# Altium project DGCtrl.PrjPcb
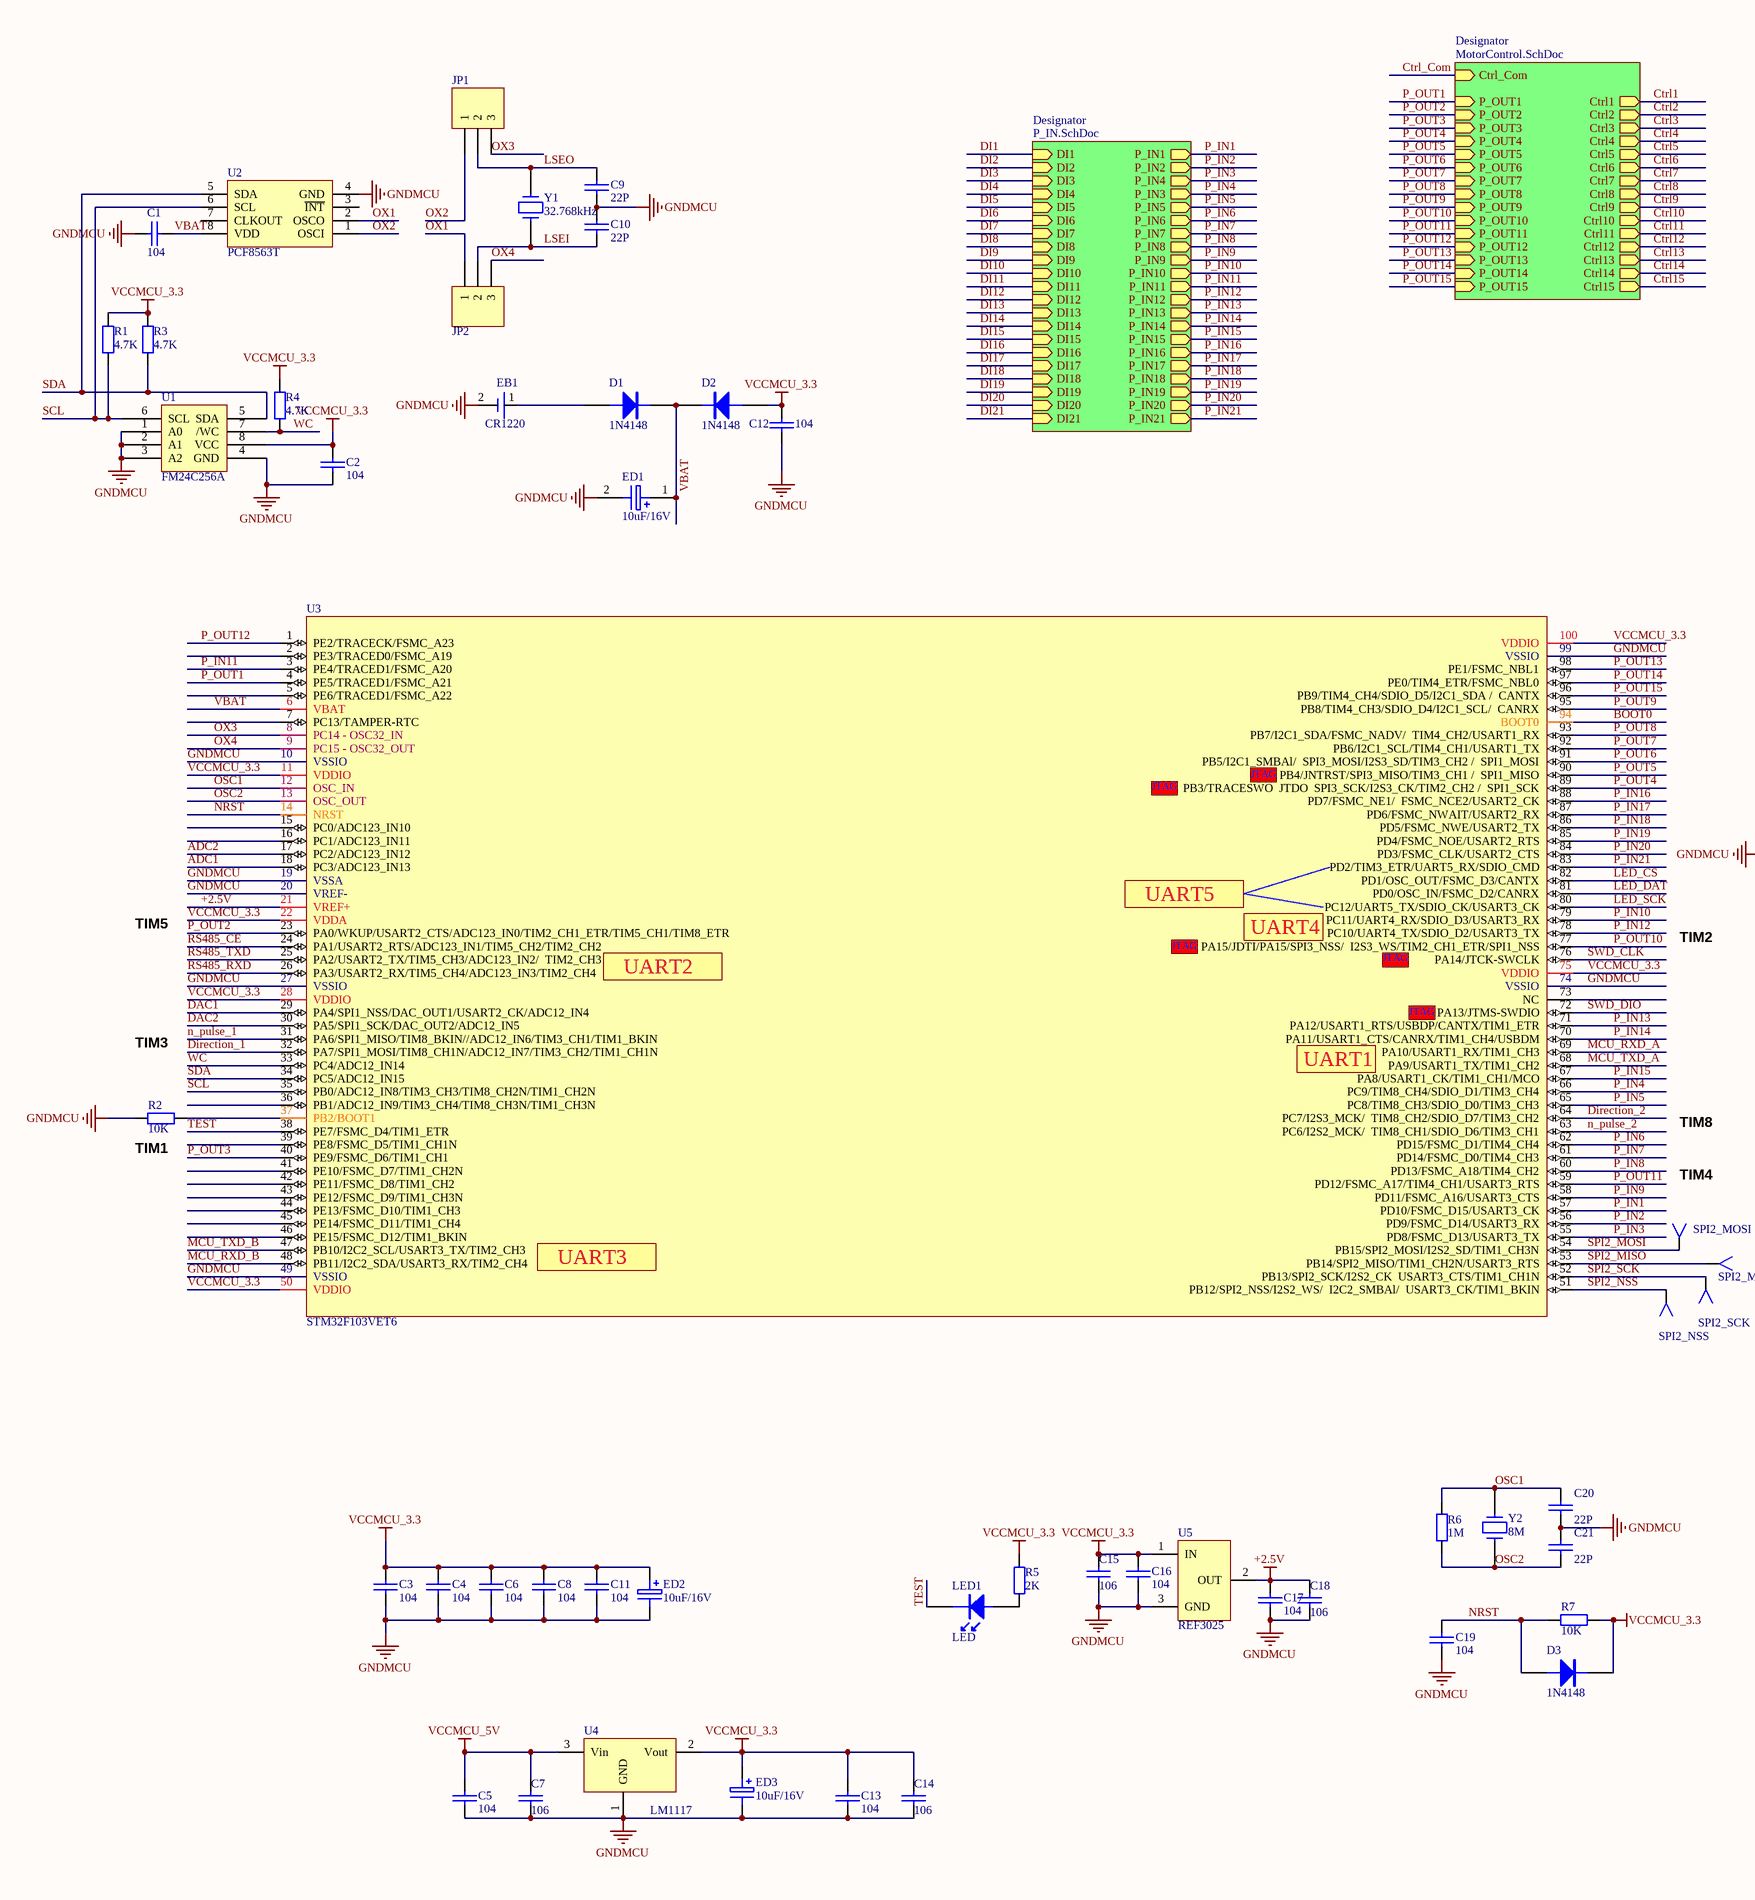
[diagram p0: DGCtrl.SchDoc, left]
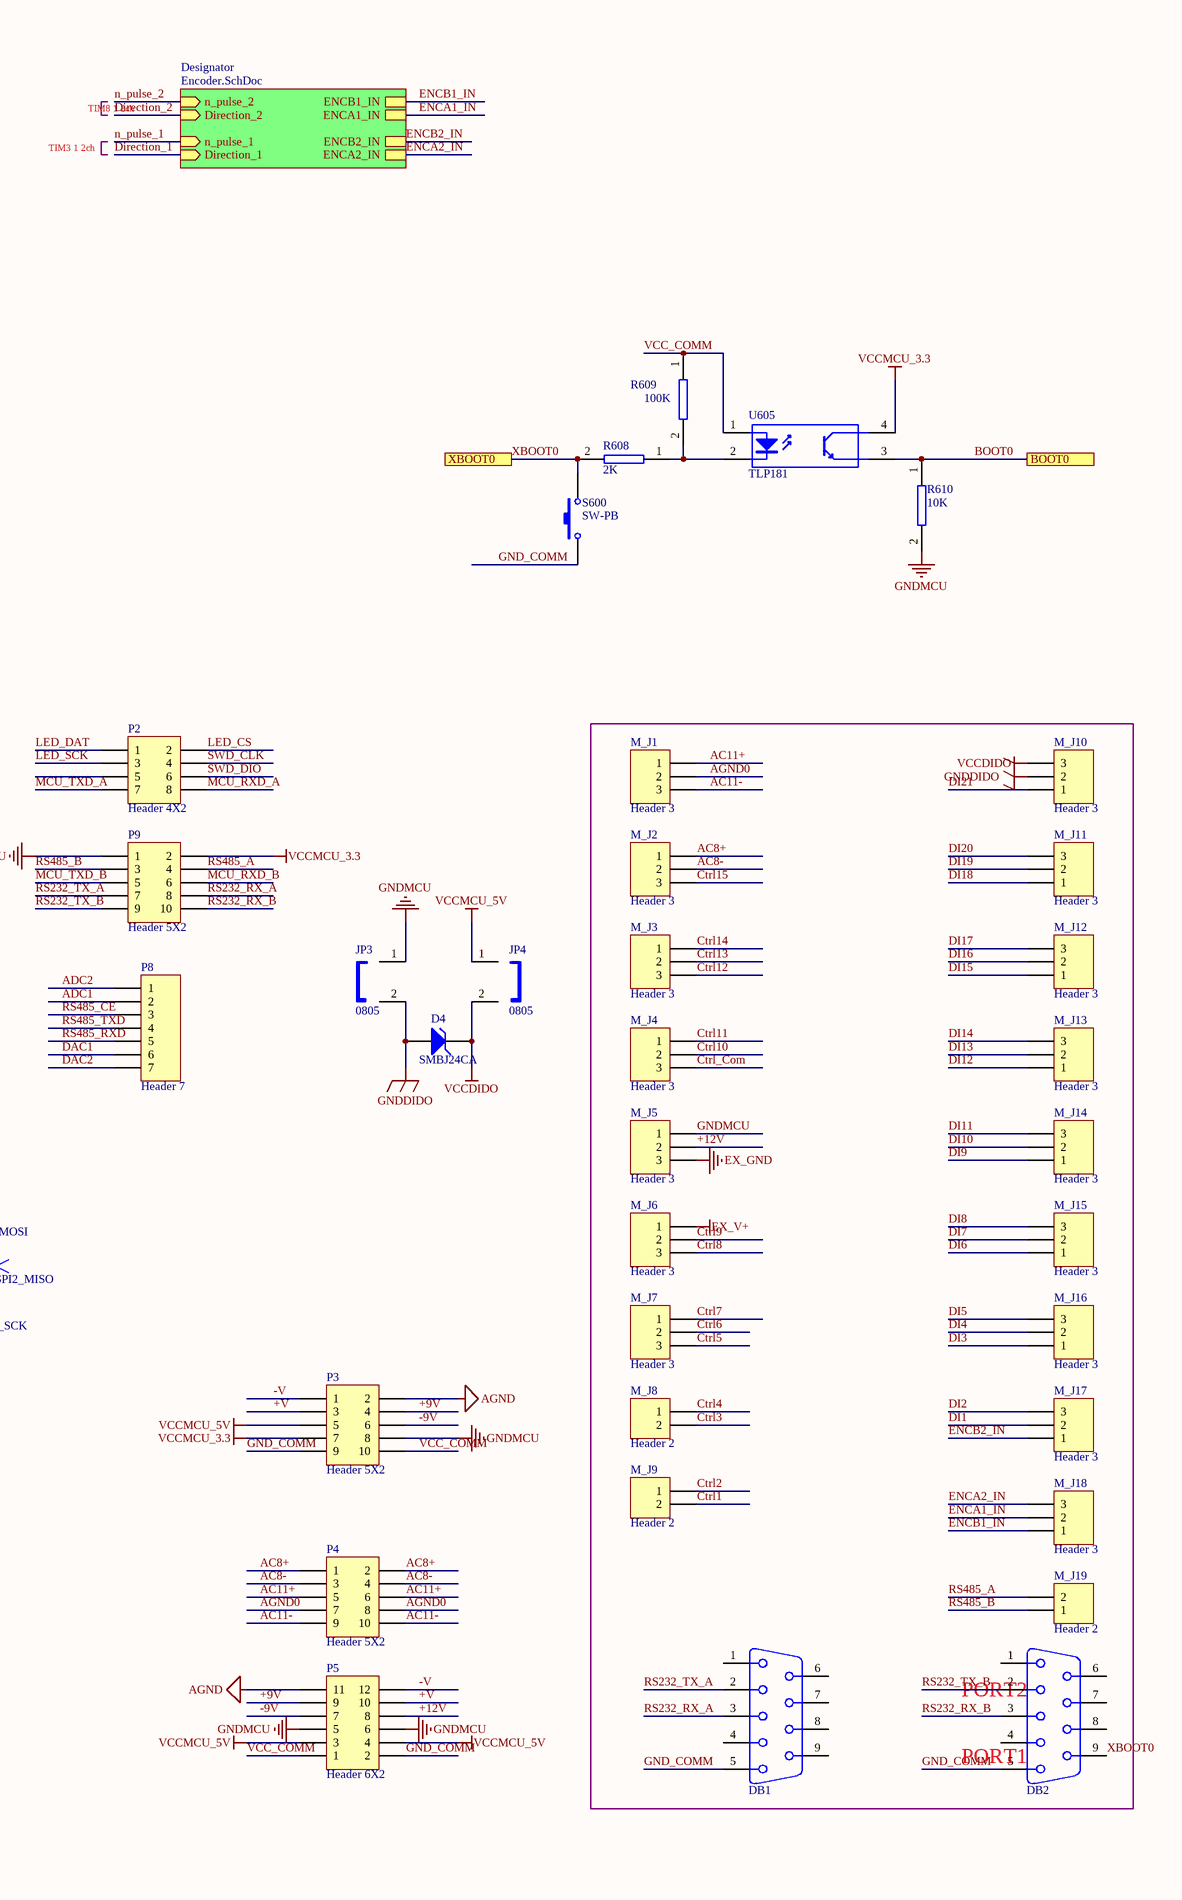
[diagram p1: DGCtrl.SchDoc, right]
4 sheets, 304 parts. Net scope: hierarchical (ports join the sheet entries above them; power ports are global).
Board file: DGCtrl.PcbDoc
Sheets:
  DGCtrl.SchDoc
    Designator = MotorControl.SchDoc
    Designator = P_IN.SchDoc
    Designator = Encoder.SchDoc

## Sheet DGCtrl.SchDoc
size A2

### Parts
C1  104  [CAPC_E0805_2012X70N]
C2  104  [CAPC_E0805_2012X70N]
C3  104  [CAPC_E0805_2012X70N]
C4  104  [CAPC_E0805_2012X70N]
C5  104  [CAPC_E0805_2012X70N]
C6  104  [CAPC_E0805_2012X70N]
C7  106  [CAPC_E0805_2012X70N]
C8  104  [CAPC_E0805_2012X70N]
C9  22P  [CAPC_E0805_2012X70N]
C10  22P  [CAPC_E0805_2012X70N]
C11  104  [CAPC_E0805_2012X70N]
C12  104  [CAPC_E0805_2012X70N]
C13  104  [CAPC_E0805_2012X70N]
C14  106  [CAPC_E0805_2012X70N]
C15  106  [CAPC_E0805_2012X70N]
C16  104  [CAPC_E0805_2012X70N]
C17  104  [CAPC_E0805_2012X70N]
C18  106  [CAPC_E0805_2012X70N]
C19  104  [CAPC_E0805_2012X70N]
C20  22P  [CAPC_E0805_2012X70N]
C21  22P  [CAPC_E0805_2012X70N]
D1  1N4148  [N4148]
D2  1N4148  [N4148]
D3  1N4148  [N4148]
D4  SMBJ24CA  [SMB]
DB1  DB9_1  [DB9-DIP]  (value not drawn)
DB2  DB9_1  [DB9-DIP]  (value not drawn)
EB1  CR1220  [CR1220]
ED1  10uF/16V  [3528]
ED2  10uF/16V  [3528]
ED3  10uF/16V  [3528]
JP1  Header 3  [JP-3]  (value not drawn)
JP2  Header 3  [JP-3]  (value not drawn)
JP3  0805  [RESC_E0805_2012X50N]
JP4  0805  [RESC_E0805_2012X50N]
LED1  LED  [LED0805]
M_J1  Header 3  [DG5.08-3]
M_J2  Header 3  [DG5.08-3]
M_J3  Header 3  [DG5.08-3]
M_J4  Header 3  [DG5.08-3]
M_J5  Header 3  [DG5.08-3]
M_J6  Header 3  [DG5.08-3]
M_J7  Header 3  [DG5.08-3]
M_J8  Header 2  [DG5.08-2]
M_J9  Header 2  [DG5.08-2]
M_J10  Header 3  [DG5.08-3]
M_J11  Header 3  [DG5.08-3]
M_J12  Header 3  [DG5.08-3]
M_J13  Header 3  [DG5.08-3]
M_J14  Header 3  [DG5.08-3]
M_J15  Header 3  [DG5.08-3]
M_J16  Header 3  [DG5.08-3]
M_J17  Header 3  [DG5.08-3]
M_J18  Header 3  [DG5.08-3]
M_J19  Header 2  [DG5.08-2]
P2  Header 4X2  [HDR2X4]
P3  Header 5X2  [HDR2X5]
P4  Header 5X2  [HDR2X5]
P5  Header 6X2  [HDR2X6]
P8  Header 7  [HDR1X7]
P9  Header 5X2  [HDR2X5]
R1  4.7K  [RESC_E0805_2012X50N]
R2  10K  [RESC_E0805_2012X50N]
R3  4.7K  [RESC_E0805_2012X50N]
R4  4.7K  [RESC_E0805_2012X50N]
R5  2K  [RESC_E0805_2012X50N]
R6  1M  [RESC_E0805_2012X50N]
R7  10K  [RESC_E0805_2012X50N]
R608  2K  [RESC_E0805_2012X50N]
R609  100K  [RESC_E0805_2012X50N]
R610  10K  [RESC_E0805_2012X50N]
S600  SW-PB  [my-key2]
SPI2_MISO  TestPoint  [Hole]  (value not drawn)  (no BOM)
SPI2_MOSI  TestPoint  [Hole]  (value not drawn)  (no BOM)
SPI2_NSS  TestPoint  [Hole]  (value not drawn)  (no BOM)
SPI2_SCK  TestPoint  [Hole]  (value not drawn)  (no BOM)
U1  FM24C256A  [SOP8_208Mil]
U2  PCF8563T  [SO-8]
U3  STM32F103VET6  [LQFP-100]
U4  LM1117  [SOT-252]
U5  REF3025  [SOT-23]
U605  TLP181  [TLP181]
Y1  32.768kHz  [XTAL2A]
Y2  8M  [JZ]

### Sub-sheets
Designator = MotorControl.SchDoc: Ctrl_Com (in), P_OUT15 (in), Ctrl14 (out), Ctrl10 (out), Ctrl13 (out), Ctrl8 (out), Ctrl7 (out), Ctrl12 (out), P_OUT1 (in), P_OUT2 (in), P_OUT5 (in), P_OUT6 (in), P_OUT7 (in), P_OUT8 (in), P_OUT9 (in), P_OUT10 (in), P_OUT11 (in), P_OUT12 (in), P_OUT13 (in), P_OUT4 (in), P_OUT3 (in), Ctrl9 (out), Ctrl11 (out), Ctrl15 (out), Ctrl6 (out), Ctrl5 (out), Ctrl4 (out), P_OUT14 (in), Ctrl3 (out), Ctrl2 (out), Ctrl1 (out)
Designator = P_IN.SchDoc: DI13 (in), DI12 (in), DI11 (in), DI21 (in), DI20 (in), DI16 (in), DI15 (in), DI14 (in), DI19 (in), DI18 (in), DI17 (in), DI5 (in), DI6 (in), DI4 (in), DI3 (in), DI7 (in), DI10 (in), DI2 (in), P_IN5 (out), DI1 (in), DI9 (in), DI8 (in), P_IN4 (out), P_IN3 (out), P_IN2 (out), P_IN6 (out), P_IN7 (out), P_IN8 (out), P_IN9 (out), P_IN10 (out), P_IN11 (out), P_IN12 (out), P_IN13 (out), P_IN14 (out), P_IN15 (out), P_IN16 (out), P_IN17 (out), P_IN18 (out), P_IN19 (out), P_IN20 (out), P_IN21 (out), P_IN1 (out)
Designator = Encoder.SchDoc: Direction_1 (in), n_pulse_1 (in), Direction_2 (in), n_pulse_2 (in), ENCA1_IN, ENCB1_IN, ENCA2_IN, ENCB2_IN

### Ports
BOOT0, XBOOT0

### Nets
+2.5V: C17.1 C18.2 U3.21(VREF+) U5.2(OUT)
AGND: P3.2 P5.11
EX_GND: M_J5.3
EX_V+: M_J6.1
GNDDIDO: D4.1(A) JP3.2 M_J10.2
GNDMCU: C1.2 C2.1 C3.2 C4.2 C5.2 C6.2 C7.1 C8.2 C9.2 C10.1 C11.2 C12.2 C13.2 C14.1 C15.1 C16.2 C17.2 C18.1 C19.2 C20.1 C21.2 EB1.2(-) ED1.2 ED2.2 ED3.2 JP3.1 M_J5.1 P3.8 P5.5 P5.6 P9.1 R2.1 R610.2 U1.1(A0) U1.2(A1) U1.3(A2) U1.4(GND) U2.4(GND) U3.10(VSSIO) U3.19(VSSA) U3.20(VREF-) U3.27(VSSIO) U3.49(VSSIO) U3.74(VSSIO) U3.99(VSSIO) U4.1(GND) U5.3(GND)
VCCDIDO: D4.2(K) JP4.2 M_J10.3
VCCMCU_3.3: C2.2 C3.1 C4.1 C6.1 C8.1 C11.1 C12.1 C13.1 C14.2 C15.2 C16.1 D2.1(A) D3.2(K) ED2.1 ED3.1 P3.7 P9.2 R1.2 R3.2 R4.2 R5.2 R7.2 U1.8(VCC) U3.11(VDDIO) U3.22(VDDA) U3.28(VDDIO) U3.50(VDDIO) U3.75(VDDIO) U3.100(VDDIO) U4.2(Vout) U5.1(IN) U605.4
VCCMCU_5V: C5.1 C7.2 JP4.1 P3.5 P5.3 P5.4 U4.3(Vin)
+9V: P3.4 P5.9
+12V: M_J5.2 P5.8
+V: P3.3 P5.10
-9V: P3.6 P5.7
-V: P3.1 P5.12
AC8+: M_J2.1 P4.1 P4.2
AC8-: M_J2.2 P4.3 P4.4
AC11+: M_J1.1 P4.5 P4.6
AC11-: M_J1.3 P4.9 P4.10
ADC1: P8.2 U3.18(PC3/ADC123_IN13)
ADC2: P8.1 U3.17(PC2/ADC123_IN12)
AGND0: M_J1.2 P4.7 P4.8
BOOT0: R610.1 U3.94(BOOT0) U605.3 ; port BOOT0
Ctrl1: M_J9.2 ; sheet Designator/Ctrl1
Ctrl2: M_J9.1 ; sheet Designator/Ctrl2
Ctrl3: M_J8.2 ; sheet Designator/Ctrl3
Ctrl4: M_J8.1 ; sheet Designator/Ctrl4
Ctrl5: M_J7.3 ; sheet Designator/Ctrl5
Ctrl6: M_J7.2 ; sheet Designator/Ctrl6
Ctrl7: M_J7.1 ; sheet Designator/Ctrl7
Ctrl8: M_J6.3 ; sheet Designator/Ctrl8
Ctrl9: M_J6.2 ; sheet Designator/Ctrl9
Ctrl10: M_J4.2 ; sheet Designator/Ctrl10
Ctrl11: M_J4.1 ; sheet Designator/Ctrl11
Ctrl12: M_J3.3 ; sheet Designator/Ctrl12
Ctrl13: M_J3.2 ; sheet Designator/Ctrl13
Ctrl14: M_J3.1 ; sheet Designator/Ctrl14
Ctrl15: M_J2.3 ; sheet Designator/Ctrl15
Ctrl_Com: M_J4.3 ; sheet Designator/Ctrl_Com
DAC1: P8.6 U3.29(PA4/SPI1_NSS/DAC_OUT1/USART2_CK/ADC12_IN4)
DAC2: P8.7 U3.30(PA5/SPI1_SCK/DAC_OUT2/ADC12_IN5)
DI1: M_J17.2 ; sheet Designator/DI1
DI2: M_J17.3 ; sheet Designator/DI2
DI3: M_J16.1 ; sheet Designator/DI3
DI4: M_J16.2 ; sheet Designator/DI4
DI5: M_J16.3 ; sheet Designator/DI5
DI6: M_J15.1 ; sheet Designator/DI6
DI7: M_J15.2 ; sheet Designator/DI7
DI8: M_J15.3 ; sheet Designator/DI8
DI9: M_J14.1 ; sheet Designator/DI9
DI10: M_J14.2 ; sheet Designator/DI10
DI11: M_J14.3 ; sheet Designator/DI11
DI12: M_J13.1 ; sheet Designator/DI12
DI13: M_J13.2 ; sheet Designator/DI13
DI14: M_J13.3 ; sheet Designator/DI14
DI15: M_J12.1 ; sheet Designator/DI15
DI16: M_J12.2 ; sheet Designator/DI16
DI17: M_J12.3 ; sheet Designator/DI17
DI18: M_J11.1 ; sheet Designator/DI18
DI19: M_J11.2 ; sheet Designator/DI19
DI20: M_J11.3 ; sheet Designator/DI20
DI21: M_J10.1 ; sheet Designator/DI21
Direction_1: U3.32(PA7/SPI1_MOSI/TIM8_CH1N/ADC12_IN7/TIM3_CH2/TIM1_CH1N) ; sheet Designator/Direction_1
Direction_2: U3.64(PC7/I2S3_MCK/__TIM8_CH2/SDIO_D7/TIM3_CH2) ; sheet Designator/Direction_2
ENCA1_IN: M_J18.2 ; sheet Designator/ENCA1_IN
ENCA2_IN: M_J18.3 ; sheet Designator/ENCA2_IN
ENCB1_IN: M_J18.1 ; sheet Designator/ENCB1_IN
ENCB2_IN: M_J17.1 ; sheet Designator/ENCB2_IN
GND_COMM: DB1.5(GND) DB2.5(GND) P3.9 P5.2 S600.1
LED_CS: P2.2 U3.82(PD1/OSC_OUT/FSMC_D3/CANTX)
LED_DAT: P2.1 U3.81(PD0/OSC_IN/FSMC_D2/CANRX)
LED_SCK: P2.3 U3.80(PC12/UART5_TX/SDIO_CK/USART3_CK)
LSEI: C10.2 JP2.2 Y1.2
LSEO: C9.1 JP1.2 Y1.1
MCU_RXD_A: P2.8 U3.69(PA10/USART1_RX/TIM1_CH3)
MCU_RXD_B: P9.6 U3.48(PB11/I2C2_SDA/USART3_RX/TIM2_CH4)
MCU_TXD_A: P2.7 U3.68(PA9/USART1_TX/TIM1_CH2)
MCU_TXD_B: P9.5 U3.47(PB10/I2C2_SCL/USART3_TX/TIM2_CH3)
n_pulse_1: U3.31(PA6/SPI1_MISO/TIM8_BKIN//ADC12_IN6/TIM3_CH1/TIM1_BKIN) ; sheet Designator/n_pulse_1
n_pulse_2: U3.63(PC6/I2S2_MCK/__TIM8_CH1/SDIO_D6/TIM3_CH1) ; sheet Designator/n_pulse_2
NRST: C19.1 D3.1(A) R7.1 U3.14(NRST)
OSC1: C20.2 R6.2 U3.12(OSC_IN) Y2.2
OSC2: C21.1 R6.1 U3.13(OSC_OUT) Y2.1
OX1: JP2.1 U2.2(OSCO)
OX2: JP1.1 U2.1(OSCI)
OX3: JP1.3 U3.8(PC14_-_OSC32_IN)
OX4: JP2.3 U3.9(PC15_-_OSC32_OUT)
P_IN1: U3.57(PD10/FSMC_D15/USART3_CK) ; sheet Designator/P_IN1
P_IN2: U3.56(PD9/FSMC_D14/USART3_RX) ; sheet Designator/P_IN2
P_IN3: U3.55(PD8/FSMC_D13/USART3_TX) ; sheet Designator/P_IN4
P_IN4: U3.66(PC9/TIM8_CH4/SDIO_D1/TIM3_CH4) ; sheet Designator/P_IN3
P_IN5: U3.65(PC8/TIM8_CH3/SDIO_D0/TIM3_CH3) ; sheet Designator/P_IN5
P_IN6: U3.62(PD15/FSMC_D1/TIM4_CH4) ; sheet Designator/P_IN6
P_IN7: U3.61(PD14/FSMC_D0/TIM4_CH3) ; sheet Designator/P_IN7
P_IN8: U3.60(PD13/FSMC_A18/TIM4_CH2) ; sheet Designator/P_IN8
P_IN9: U3.58(PD11/FSMC_A16/USART3_CTS) ; sheet Designator/P_IN9
P_IN10: U3.79(PC11/UART4_RX/SDIO_D3/USART3_RX) ; sheet Designator/P_IN10
P_IN11: U3.3(PE4/TRACED1/FSMC_A20) ; sheet Designator/P_IN11
P_IN12: U3.78(PC10/UART4_TX/SDIO_D2/USART3_TX) ; sheet Designator/P_IN12
P_IN13: U3.71(PA12/USART1_RTS/USBDP/CANTX/TIM1_ETR) ; sheet Designator/P_IN13
P_IN14: U3.70(PA11/USART1_CTS/CANRX/TIM1_CH4/USBDM) ; sheet Designator/P_IN14
P_IN15: U3.67(PA8/USART1_CK/TIM1_CH1/MCO) ; sheet Designator/P_IN15
P_IN16: U3.88(PD7/FSMC_NE1/__FSMC_NCE2/USART2_CK) ; sheet Designator/P_IN16
P_IN17: U3.87(PD6/FSMC_NWAIT/USART2_RX) ; sheet Designator/P_IN17
P_IN18: U3.86(PD5/FSMC_NWE/USART2_TX) ; sheet Designator/P_IN18
P_IN19: U3.85(PD4/FSMC_NOE/USART2_RTS) ; sheet Designator/P_IN19
P_IN20: U3.84(PD3/FSMC_CLK/USART2_CTS) ; sheet Designator/P_IN20
P_IN21: U3.83(PD2/TIM3_ETR/UART5_RX/SDIO_CMD) ; sheet Designator/P_IN21
P_OUT1: U3.4(PE5/TRACED1/FSMC_A21) ; sheet Designator/P_OUT1
P_OUT2: U3.23(PA0/WKUP/USART2_CTS/ADC123_IN0/TIM2_CH1_ETR/TIM5_CH1/TIM8_ETR) ; sheet Designator/P_OUT2
P_OUT3: U3.40(PE9/FSMC_D6/TIM1_CH1) ; sheet Designator/P_OUT3
P_OUT4: U3.89(PB3/TRACESWO__JTDO__SPI3_SCK/I2S3_CK/TIM2_CH2_/__SPI1_SCK) ; sheet Designator/P_OUT4
P_OUT5: U3.90(PB4/JNTRST/SPI3_MISO/TIM3_CH1_/__SPI1_MISO) ; sheet Designator/P_OUT5
P_OUT6: U3.91(PB5/I2C1_SMBAl/__SPI3_MOSI/I2S3_SD/TIM3_CH2_/__SPI1_MOSI) ; sheet Designator/P_OUT6
P_OUT7: U3.92(PB6/I2C1_SCL/TIM4_CH1/USART1_TX) ; sheet Designator/P_OUT7
P_OUT8: U3.93(PB7/I2C1_SDA/FSMC_NADV/__TIM4_CH2/USART1_RX) ; sheet Designator/P_OUT8
P_OUT9: U3.95(PB8/TIM4_CH3/SDIO_D4/I2C1_SCL/__CANRX) ; sheet Designator/P_OUT9
P_OUT10: U3.77(PA15/JDTI/PA15/SPI3_NSS/__I2S3_WS/TIM2_CH1_ETR/SPI1_NSS) ; sheet Designator/P_OUT10
P_OUT11: U3.59(PD12/FSMC_A17/TIM4_CH1/USART3_RTS) ; sheet Designator/P_OUT11
P_OUT12: U3.1(PE2/TRACECK/FSMC_A23) ; sheet Designator/P_OUT12
P_OUT13: U3.98(PE1/FSMC_NBL1) ; sheet Designator/P_OUT13
P_OUT14: U3.97(PE0/TIM4_ETR/FSMC_NBL0) ; sheet Designator/P_OUT14
P_OUT15: U3.96(PB9/TIM4_CH4/SDIO_D5/I2C1_SDA_/__CANTX) ; sheet Designator/P_OUT15
RS232_RX_A: DB1.3(TXD) P9.8
RS232_RX_B: DB2.3(TXD) P9.10
RS232_TX_A: DB1.2(RXD) P9.7
RS232_TX_B: DB2.2(RXD) P9.9
RS485_A: M_J19.2 P9.4
RS485_B: M_J19.1 P9.3
RS485_CE: P8.3 U3.24(PA1/USART2_RTS/ADC123_IN1/TIM5_CH2/TIM2_CH2)
RS485_RXD: P8.5 U3.26(PA3/USART2_RX/TIM5_CH4/ADC123_IN3/TIM2_CH4)
RS485_TXD: P8.4 U3.25(PA2/USART2_TX/TIM5_CH3/ADC123_IN2/__TIM2_CH3)
SCL: R1.1 U1.6(SCL) U2.6(SCL) U3.35(PB0/ADC12_IN8/TIM3_CH3/TIM8_CH2N/TIM1_CH2N)
SDA: R3.1 U1.5(SDA) U2.5(SDA) U3.34(PC5/ADC12_IN15)
SPI2_MISO: SPI2_MISO.1 U3.53(PB14/SPI2_MISO/TIM1_CH2N/USART3_RTS)
SPI2_MOSI: SPI2_MOSI.1 U3.54(PB15/SPI2_MOSI/I2S2_SD/TIM1_CH3N)
SPI2_NSS: SPI2_NSS.1 U3.51(PB12/SPI2_NSS/I2S2_WS/__I2C2_SMBAl/__USART3_CK/TIM1_BKIN)
SPI2_SCK: SPI2_SCK.1 U3.52(PB13/SPI2_SCK/I2S2_CK__USART3_CTS/TIM1_CH1N)
SWD_CLK: P2.4 U3.76(PA14/JTCK-SWCLK)
SWD_DIO: P2.6 U3.72(PA13/JTMS-SWDIO)
TEST: LED1.2 U3.38(PE7/FSMC_D4/TIM1_ETR)
VBAT: C1.1 D1.2(K) D2.2(K) ED1.1 U2.8(VDD) U3.6(VBAT)
VCC_COMM: P3.10 P5.1 R609.1 U605.1
WC: R4.1 U1.7(/WC) U3.33(PC4/ADC12_IN14)
XBOOT0: DB2.9(DELL) R608.2 S600.2 ; port XBOOT0
NetD1_1: D1.1(A) EB1.1(+)
NetLED1_1: LED1.1 R5.1
NetR2_2: R2.2 U3.37(PB2/BOOT1)
NetR608_1: R608.1 R609.2 U605.2

Not connected (* = marked no-connect by the designer): DB1 1(DCD) 4(DTR) 6(DSR) 7(RTS) 8(CTS) 9(DELL); DB2 1(DCD) 4(DTR) 6(DSR) 7(RTS) 8(CTS); P2 5; U2 3(~{INT}) 7(CLKOUT); U3 2(PE3/TRACED0/FSMC_A19) 5(PE6/TRACED1/FSMC_A22) 7(PC13/TAMPER-RTC) 15(PC0/ADC123_IN10) 16(PC1/ADC123_IN11) 36(PB1/ADC12_IN9/TIM3_CH4/TIM8_CH3N/TIM1_CH3N) 39(PE8/FSMC_D5/TIM1_CH1N) 41(PE10/FSMC_D7/TIM1_CH2N) 42(PE11/FSMC_D8/TIM1_CH2) 43(PE12/FSMC_D9/TIM1_CH3N) 44(PE13/FSMC_D10/TIM1_CH3) 45(PE14/FSMC_D11/TIM1_CH4) 46(PE15/FSMC_D12/TIM1_BKIN) 73(NC)

### Notes on the sheet
- TIM8 1 2ch
- TIM3 1 2ch
- TIM5
- TIM2
- TIM3
- TIM8
- (near R2) TIM1
- TIM4
- (near DB2) PORT2
- (near DB2) PORT1
- (in symbol STM32F103VET6) JTAG; UART5; UART4; UART2; UART1; UART3

### Library data of the parts
C1-C21 = CAP: Capacitor
D1-D3 = DIODE
D4 = D Zener: Zener Diode; Published: 8-Jun-2000; LatestRevisionDate: 17-Jul-2002; LatestRevisionNote: Re-released for DXP Platform.; PackageReference: DIODE-0.7; Publisher: Altium Limited
DB1 DB2 = DB9_1: Female
EB1 = E-3.6V
ED1 = ELECTRO1: Electrolytic Capacitor
ED2 ED3 = ELECTRO1
JP1 JP2 M_J1-M_J7 M_J10-M_J18 = Header 3: Header, 3-Pin; LatestRevisionDate: 17-Jul-2002; LatestRevisionNote: Re-released for DXP Platform.; Publisher: Altium Limited
JP3 JP4 = JUMPER
LED1 = LED-PH
M_J8 M_J9 M_J19 = Header 2: Header, 2-Pin; LatestRevisionDate: 17-Jul-2002; LatestRevisionNote: Re-released for DXP Platform.; Publisher: Altium Limited
P2 = Header 4X2: Header, 4-Pin, Dual row; LatestRevisionDate: 17-Jul-2002; LatestRevisionNote: Re-released for DXP Platform.; Publisher: Altium Limited
P3 P4 P9 = Header 5X2: Header, 5-Pin, Dual row; LatestRevisionDate: 17-Jul-2002; LatestRevisionNote: Re-released for DXP Platform.; Publisher: Altium Limited
P5 = Header 6X2: Header, 6-Pin, Dual row; LatestRevisionDate: 17-Jul-2002; LatestRevisionNote: Re-released for DXP Platform.; Publisher: Altium Limited
P8 = Header 7: Header, 7-Pin; LatestRevisionDate: 17-Jul-2002; LatestRevisionNote: Re-released for DXP Platform.; Publisher: Altium Limited
R1-R7 = RES1
R608-R610 = RES2
S600 = SW-PB: Switch; Published: 24-Mar-1999; LatestRevisionDate: 17-Jul-2002; LatestRevisionNote: Re-released for DXP Platform.; PackageReference: SPST-2; Publisher: Altium Limited; PackageDescription: Switch; 2 Leads
U1 = FM24C256A: 1.7-5.5V宽电压 256K存储
U2 = PCF8563T: IIC RTC
U3 = STM32F103VET6: 512K Flash, 64K SRAM,LQFP100
U4 = LD1117A
U5 = REF3020: 2.048V ,HIGH OUTPUT CURRENT: 25mA,HIGH ACCURACY: 0.2%
U605 = N521-1
Y1 Y2 = CRYSTAL

## Sheet MotorControl.SchDoc
size A2; DocumentNumber: 2; SheetNumber: 2; SheetTotal: 9
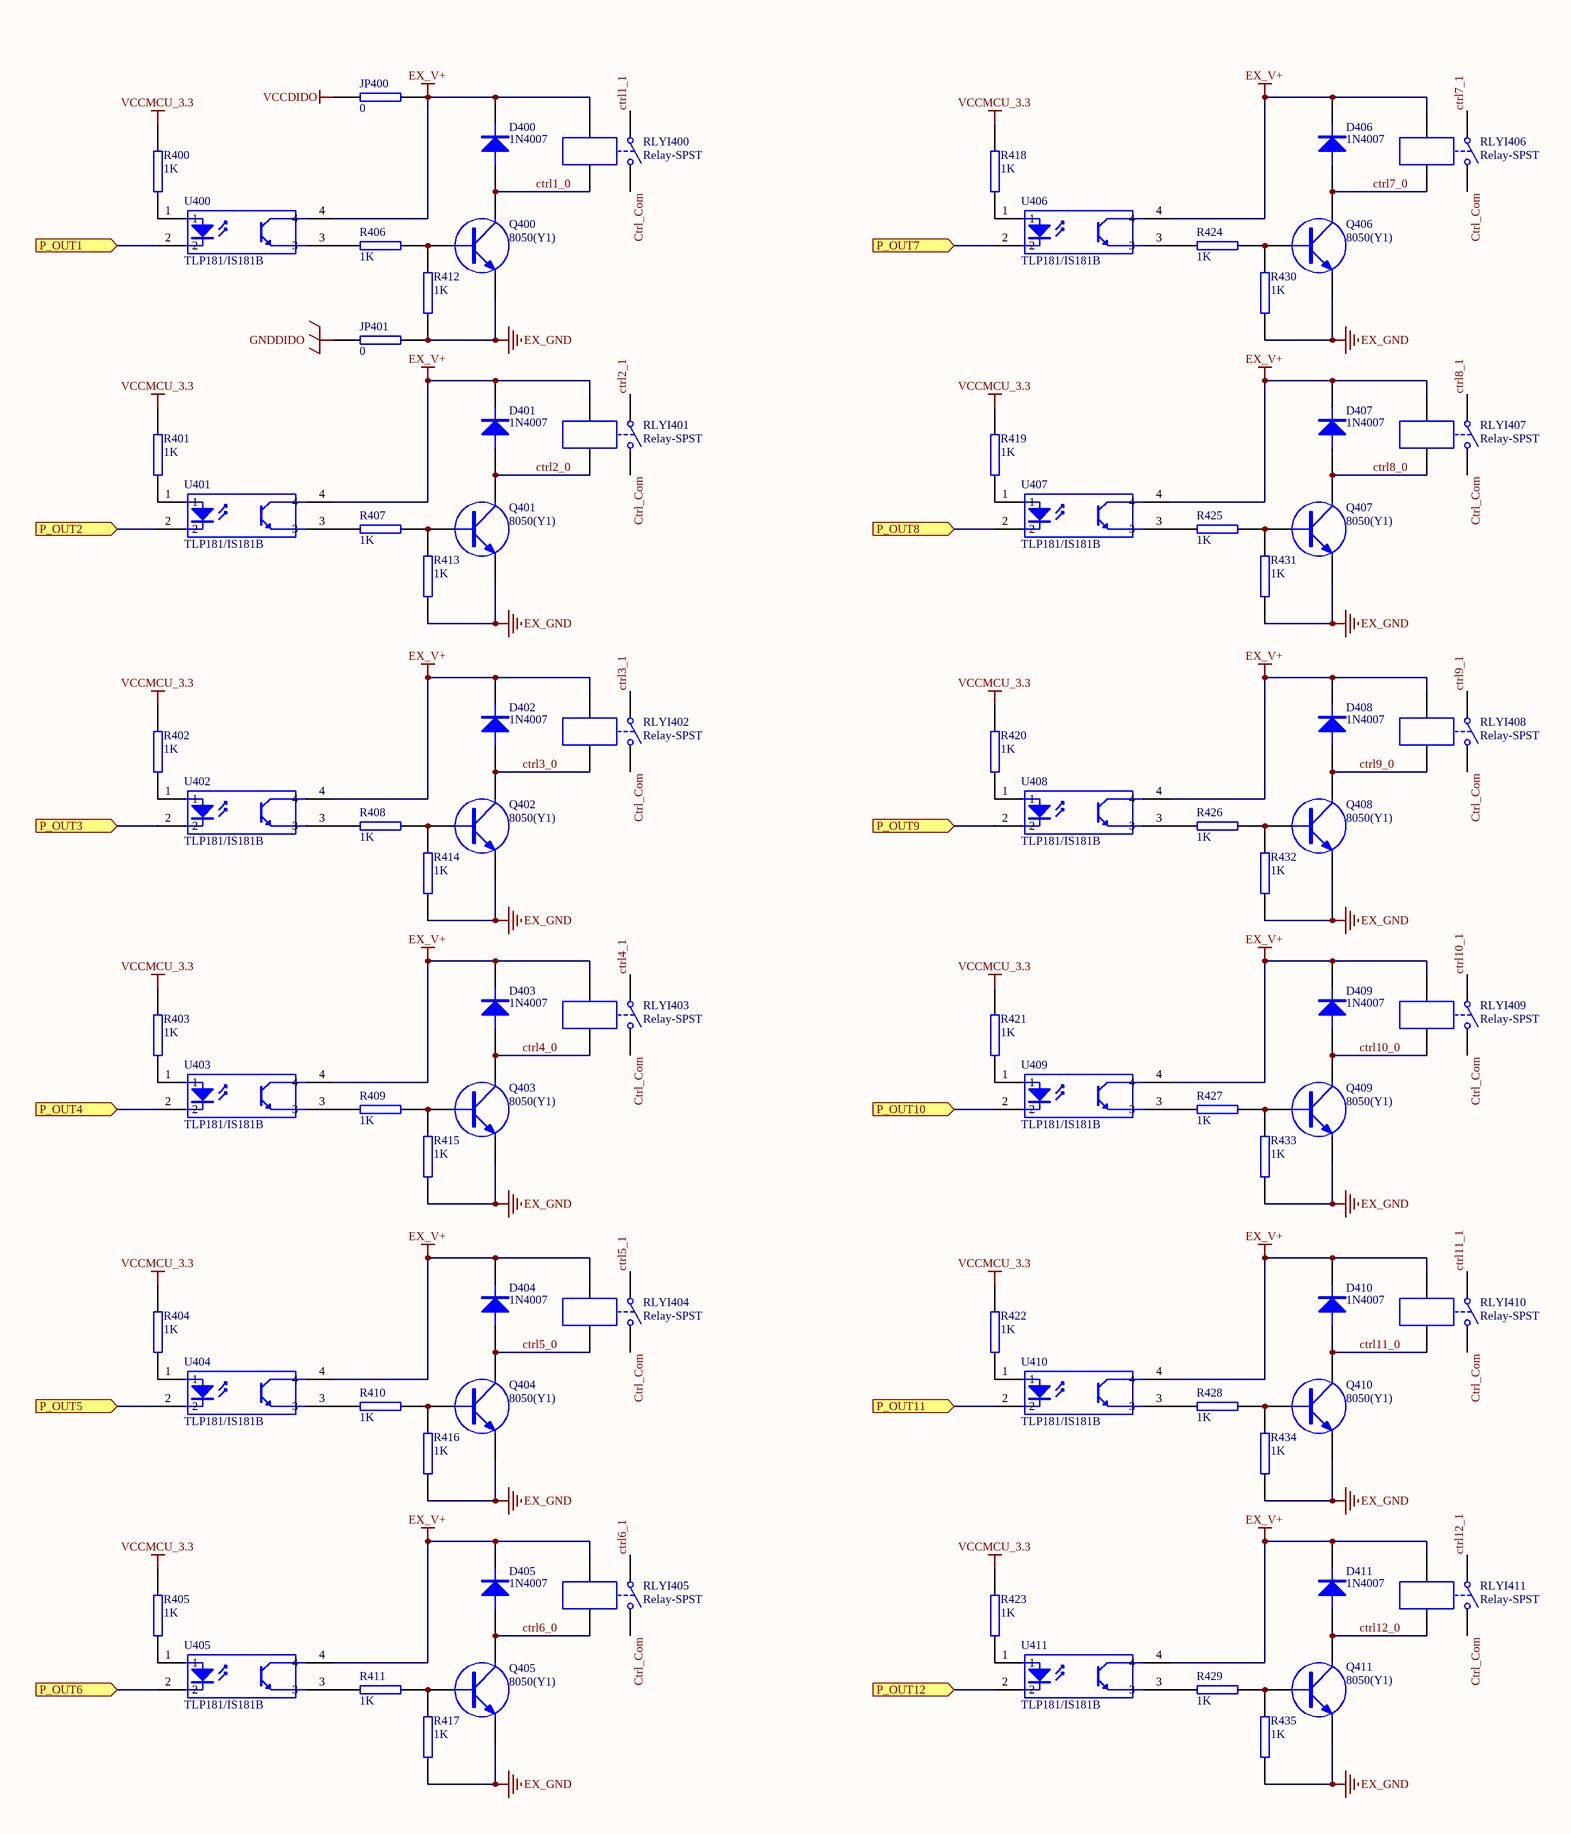
[diagram p2: MotorControl.SchDoc, left]
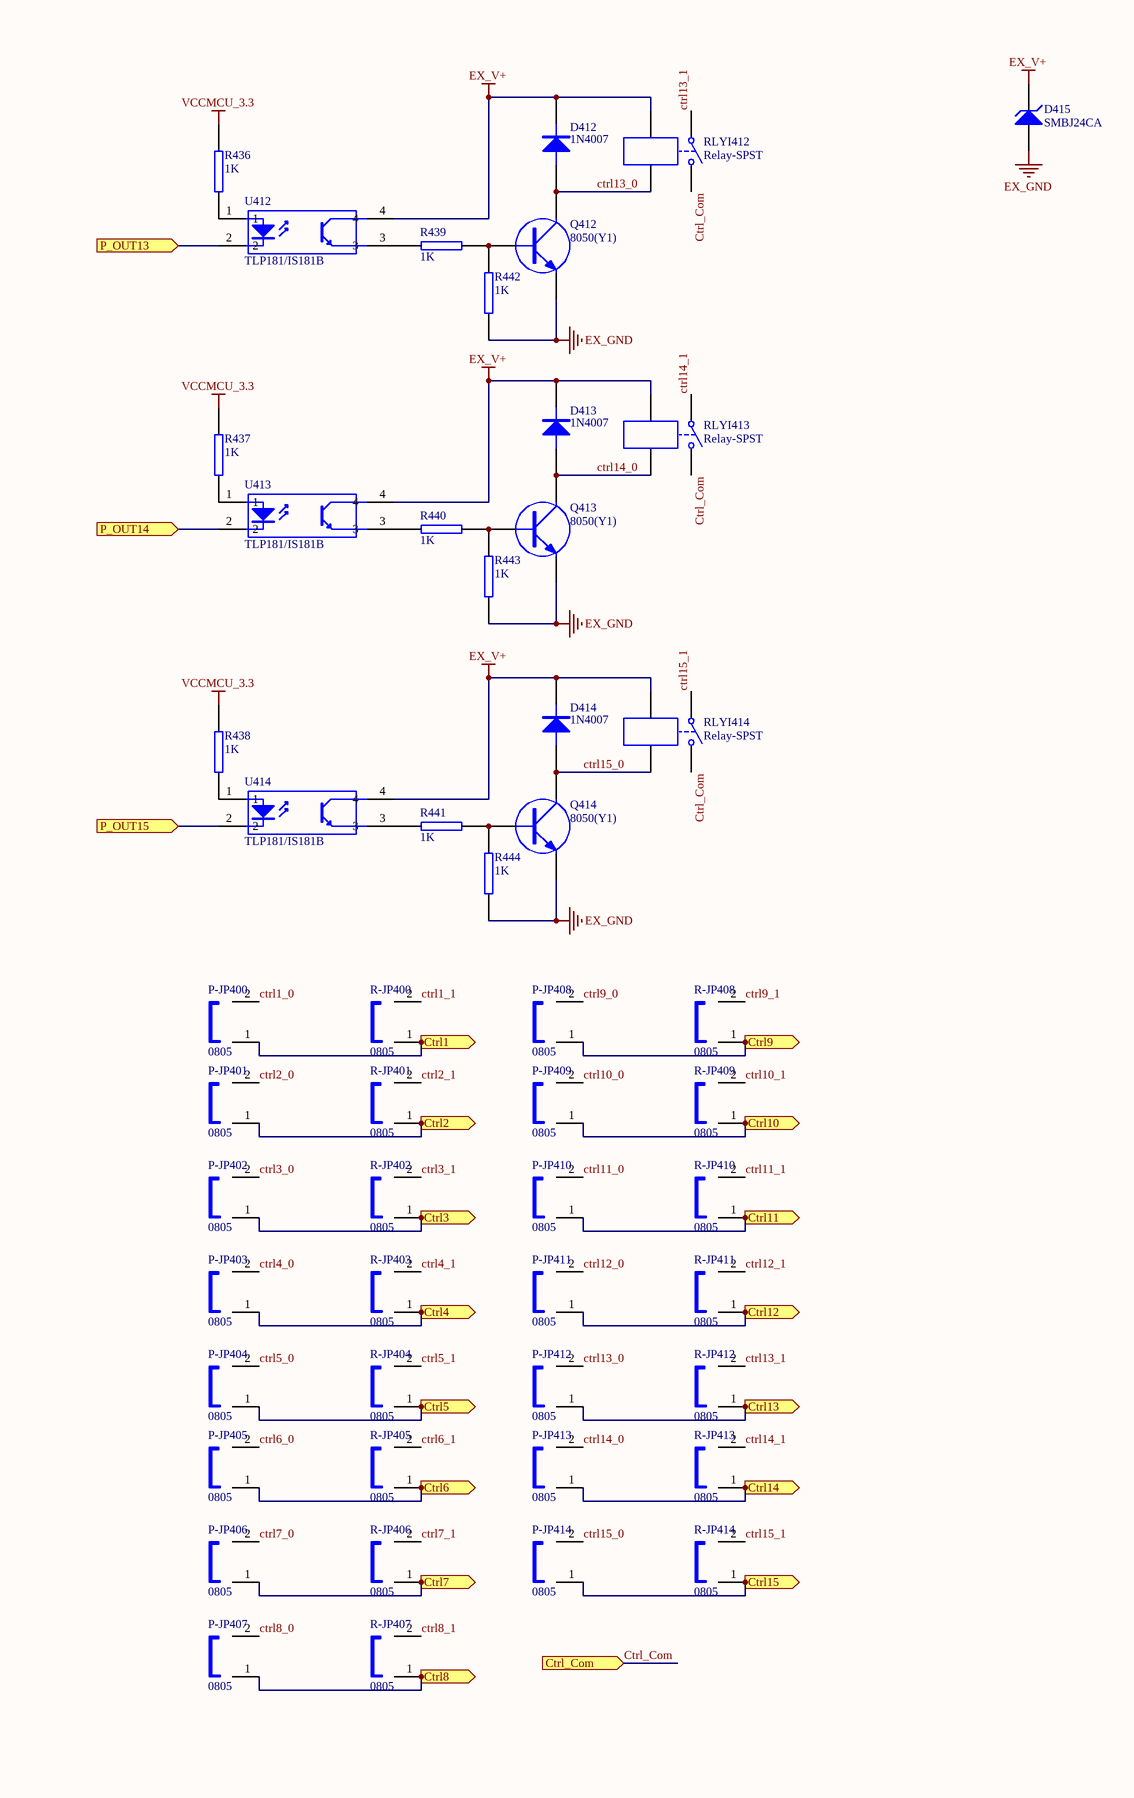
[diagram p3: MotorControl.SchDoc, right]

### Parts
D400  1N4007  [SMA]
D401  1N4007  [SMA]
D402  1N4007  [SMA]
D403  1N4007  [SMA]
D404  1N4007  [SMA]
D405  1N4007  [SMA]
D406  1N4007  [SMA]
D407  1N4007  [SMA]
D408  1N4007  [SMA]
D409  1N4007  [SMA]
D410  1N4007  [SMA]
D411  1N4007  [SMA]
D412  1N4007  [SMA]
D413  1N4007  [SMA]
D414  1N4007  [SMA]
D415  SMBJ24CA  [SMB]
JP400  0  [RESC_E0805_2012X50N]
JP401  0  [RESC_E0805_2012X50N]
P-JP400  0805  [RESC_E0805_2012X50N]
P-JP401  0805  [RESC_E0805_2012X50N]
P-JP402  0805  [RESC_E0805_2012X50N]
P-JP403  0805  [RESC_E0805_2012X50N]
P-JP404  0805  [RESC_E0805_2012X50N]
P-JP405  0805  [RESC_E0805_2012X50N]
P-JP406  0805  [RESC_E0805_2012X50N]
P-JP407  0805  [RESC_E0805_2012X50N]
P-JP408  0805  [RESC_E0805_2012X50N]
P-JP409  0805  [RESC_E0805_2012X50N]
P-JP410  0805  [RESC_E0805_2012X50N]
P-JP411  0805  [RESC_E0805_2012X50N]
P-JP412  0805  [RESC_E0805_2012X50N]
P-JP413  0805  [RESC_E0805_2012X50N]
P-JP414  0805  [RESC_E0805_2012X50N]
Q400  8050(Y1)  [SOT23_95P280X110-3N]
Q401  8050(Y1)  [SOT23_95P280X110-3N]
Q402  8050(Y1)  [SOT23_95P280X110-3N]
Q403  8050(Y1)  [SOT23_95P280X110-3N]
Q404  8050(Y1)  [SOT23_95P280X110-3N]
Q405  8050(Y1)  [SOT23_95P280X110-3N]
Q406  8050(Y1)  [SOT23_95P280X110-3N]
Q407  8050(Y1)  [SOT23_95P280X110-3N]
Q408  8050(Y1)  [SOT23_95P280X110-3N]
Q409  8050(Y1)  [SOT23_95P280X110-3N]
Q410  8050(Y1)  [SOT23_95P280X110-3N]
Q411  8050(Y1)  [SOT23_95P280X110-3N]
Q412  8050(Y1)  [SOT23_95P280X110-3N]
Q413  8050(Y1)  [SOT23_95P280X110-3N]
Q414  8050(Y1)  [SOT23_95P280X110-3N]
R400  1K  [RESC_E0805_2012X50N]
R401  1K  [RESC_E0805_2012X50N]
R402  1K  [RESC_E0805_2012X50N]
R403  1K  [RESC_E0805_2012X50N]
R404  1K  [RESC_E0805_2012X50N]
R405  1K  [RESC_E0805_2012X50N]
R406  1K  [RESC_E0805_2012X50N]
R407  1K  [RESC_E0805_2012X50N]
R408  1K  [RESC_E0805_2012X50N]
R409  1K  [RESC_E0805_2012X50N]
R410  1K  [RESC_E0805_2012X50N]
R411  1K  [RESC_E0805_2012X50N]
R412  1K  [RESC_E0805_2012X50N]
R413  1K  [RESC_E0805_2012X50N]
R414  1K  [RESC_E0805_2012X50N]
R415  1K  [RESC_E0805_2012X50N]
R416  1K  [RESC_E0805_2012X50N]
R417  1K  [RESC_E0805_2012X50N]
R418  1K  [RESC_E0805_2012X50N]
R419  1K  [RESC_E0805_2012X50N]
R420  1K  [RESC_E0805_2012X50N]
R421  1K  [RESC_E0805_2012X50N]
R422  1K  [RESC_E0805_2012X50N]
R423  1K  [RESC_E0805_2012X50N]
R424  1K  [RESC_E0805_2012X50N]
R425  1K  [RESC_E0805_2012X50N]
R426  1K  [RESC_E0805_2012X50N]
R427  1K  [RESC_E0805_2012X50N]
R428  1K  [RESC_E0805_2012X50N]
R429  1K  [RESC_E0805_2012X50N]
R430  1K  [RESC_E0805_2012X50N]
R431  1K  [RESC_E0805_2012X50N]
R432  1K  [RESC_E0805_2012X50N]
R433  1K  [RESC_E0805_2012X50N]
R434  1K  [RESC_E0805_2012X50N]
R435  1K  [RESC_E0805_2012X50N]
R436  1K  [RESC_E0805_2012X50N]
R437  1K  [RESC_E0805_2012X50N]
R438  1K  [RESC_E0805_2012X50N]
R439  1K  [RESC_E0805_2012X50N]
R440  1K  [RESC_E0805_2012X50N]
R441  1K  [RESC_E0805_2012X50N]
R442  1K  [RESC_E0805_2012X50N]
R443  1K  [RESC_E0805_2012X50N]
R444  1K  [RESC_E0805_2012X50N]
R-JP400  0805  [RESC_E0805_2012X50N]
R-JP401  0805  [RESC_E0805_2012X50N]
R-JP402  0805  [RESC_E0805_2012X50N]
R-JP403  0805  [RESC_E0805_2012X50N]
R-JP404  0805  [RESC_E0805_2012X50N]
R-JP405  0805  [RESC_E0805_2012X50N]
R-JP406  0805  [RESC_E0805_2012X50N]
R-JP407  0805  [RESC_E0805_2012X50N]
R-JP408  0805  [RESC_E0805_2012X50N]
R-JP409  0805  [RESC_E0805_2012X50N]
R-JP410  0805  [RESC_E0805_2012X50N]
R-JP411  0805  [RESC_E0805_2012X50N]
R-JP412  0805  [RESC_E0805_2012X50N]
R-JP413  0805  [RESC_E0805_2012X50N]
R-JP414  0805  [RESC_E0805_2012X50N]
RLYI400  Relay-SPST  [JDQ24V]
RLYI401  Relay-SPST  [JDQ24V]
RLYI402  Relay-SPST  [JDQ24V]
RLYI403  Relay-SPST  [JDQ24V]
RLYI404  Relay-SPST  [JDQ24V]
RLYI405  Relay-SPST  [JDQ24V]
RLYI406  Relay-SPST  [JDQ24V]
RLYI407  Relay-SPST  [JDQ24V]
RLYI408  Relay-SPST  [JDQ24V]
RLYI409  Relay-SPST  [JDQ24V]
RLYI410  Relay-SPST  [JDQ24V]
RLYI411  Relay-SPST  [JDQ24V]
RLYI412  Relay-SPST  [JDQ24V]
RLYI413  Relay-SPST  [JDQ24V]
RLYI414  Relay-SPST  [JDQ24V]
U400  TLP181/IS181B  [TLP181]
U401  TLP181/IS181B  [TLP181]
U402  TLP181/IS181B  [TLP181]
U403  TLP181/IS181B  [TLP181]
U404  TLP181/IS181B  [TLP181]
U405  TLP181/IS181B  [TLP181]
U406  TLP181/IS181B  [TLP181]
U407  TLP181/IS181B  [TLP181]
U408  TLP181/IS181B  [TLP181]
U409  TLP181/IS181B  [TLP181]
U410  TLP181/IS181B  [TLP181]
U411  TLP181/IS181B  [TLP181]
U412  TLP181/IS181B  [TLP181]
U413  TLP181/IS181B  [TLP181]
U414  TLP181/IS181B  [TLP181]

### Ports
Ctrl1 (out), Ctrl2 (out), Ctrl3 (out), Ctrl4 (out), Ctrl5 (out), Ctrl6 (out), Ctrl7 (out), Ctrl8 (out), Ctrl9 (out), Ctrl10 (out), Ctrl11 (out), Ctrl12 (out), Ctrl13 (out), Ctrl14 (out), Ctrl15 (out), Ctrl_Com (in), P_OUT1 (in), P_OUT2 (in), P_OUT3 (in), P_OUT4 (in), P_OUT5 (in), P_OUT6 (in), P_OUT7 (in), P_OUT8 (in), P_OUT9 (in), P_OUT10 (in), P_OUT11 (in), P_OUT12 (in), P_OUT13 (in), P_OUT14 (in), P_OUT15 (in)

### Nets
EX_GND: D415.1(A) JP401.1 Q400.2(E) Q401.2(E) Q402.2(E) Q403.2(E) Q404.2(E) Q405.2(E) Q406.2(E) Q407.2(E) Q408.2(E) Q409.2(E) Q410.2(E) Q411.2(E) Q412.2(E) Q413.2(E) Q414.2(E) R412.1 R413.1 R414.1 R415.1 R416.1 R417.1 R430.1 R431.1 R432.1 R433.1 R434.1 R435.1 R442.1 R443.1 R444.1
EX_V+: D400.2(K) D401.2(K) D402.2(K) D403.2(K) D404.2(K) D405.2(K) D406.2(K) D407.2(K) D408.2(K) D409.2(K) D410.2(K) D411.2(K) D412.2(K) D413.2(K) D414.2(K) D415.2(K) JP400.1 RLYI400.3 RLYI401.3 RLYI402.3 RLYI403.3 RLYI404.3 RLYI405.3 RLYI406.3 RLYI407.3 RLYI408.3 RLYI409.3 RLYI410.3 RLYI411.3 RLYI412.3 RLYI413.3 RLYI414.3 U400.4 U401.4 U402.4 U403.4 U404.4 U405.4 U406.4 U407.4 U408.4 U409.4 U410.4 U411.4 U412.4 U413.4 U414.4
GNDDIDO: JP401.2
VCCDIDO: JP400.2
VCCMCU_3.3: R400.1 R401.1 R402.1 R403.1 R404.1 R405.1 R418.1 R419.1 R420.1 R421.1 R422.1 R423.1 R436.1 R437.1 R438.1
Ctrl1: P-JP400.1 R-JP400.1 ; port Ctrl1
ctrl1_0: D400.1(A) P-JP400.2 Q400.3(C) RLYI400.4
ctrl1_1: R-JP400.2 RLYI400.1
Ctrl2: P-JP401.1 R-JP401.1 ; port Ctrl2
ctrl2_0: D401.1(A) P-JP401.2 Q401.3(C) RLYI401.4
ctrl2_1: R-JP401.2 RLYI401.1
Ctrl3: P-JP402.1 R-JP402.1 ; port Ctrl3
ctrl3_0: D402.1(A) P-JP402.2 Q402.3(C) RLYI402.4
ctrl3_1: R-JP402.2 RLYI402.1
Ctrl4: P-JP403.1 R-JP403.1 ; port Ctrl4
ctrl4_0: D403.1(A) P-JP403.2 Q403.3(C) RLYI403.4
ctrl4_1: R-JP403.2 RLYI403.1
Ctrl5: P-JP404.1 R-JP404.1 ; port Ctrl5
ctrl5_0: D404.1(A) P-JP404.2 Q404.3(C) RLYI404.4
ctrl5_1: R-JP404.2 RLYI404.1
Ctrl6: P-JP405.1 R-JP405.1 ; port Ctrl6
ctrl6_0: D405.1(A) P-JP405.2 Q405.3(C) RLYI405.4
ctrl6_1: R-JP405.2 RLYI405.1
Ctrl7: P-JP406.1 R-JP406.1 ; port Ctrl7
ctrl7_0: D406.1(A) P-JP406.2 Q406.3(C) RLYI406.4
ctrl7_1: R-JP406.2 RLYI406.1
Ctrl8: P-JP407.1 R-JP407.1 ; port Ctrl8
ctrl8_0: D407.1(A) P-JP407.2 Q407.3(C) RLYI407.4
ctrl8_1: R-JP407.2 RLYI407.1
Ctrl9: P-JP408.1 R-JP408.1 ; port Ctrl9
ctrl9_0: D408.1(A) P-JP408.2 Q408.3(C) RLYI408.4
ctrl9_1: R-JP408.2 RLYI408.1
Ctrl10: P-JP409.1 R-JP409.1 ; port Ctrl10
ctrl10_0: D409.1(A) P-JP409.2 Q409.3(C) RLYI409.4
ctrl10_1: R-JP409.2 RLYI409.1
Ctrl11: P-JP410.1 R-JP410.1 ; port Ctrl11
ctrl11_0: D410.1(A) P-JP410.2 Q410.3(C) RLYI410.4
ctrl11_1: R-JP410.2 RLYI410.1
Ctrl12: P-JP411.1 R-JP411.1 ; port Ctrl12
ctrl12_0: D411.1(A) P-JP411.2 Q411.3(C) RLYI411.4
ctrl12_1: R-JP411.2 RLYI411.1
Ctrl13: P-JP412.1 R-JP412.1 ; port Ctrl13
ctrl13_0: D412.1(A) P-JP412.2 Q412.3(C) RLYI412.4
ctrl13_1: R-JP412.2 RLYI412.1
Ctrl14: P-JP413.1 R-JP413.1 ; port Ctrl14
ctrl14_0: D413.1(A) P-JP413.2 Q413.3(C) RLYI413.4
ctrl14_1: R-JP413.2 RLYI413.1
Ctrl15: P-JP414.1 R-JP414.1 ; port Ctrl15
ctrl15_0: D414.1(A) P-JP414.2 Q414.3(C) RLYI414.4
ctrl15_1: R-JP414.2 RLYI414.1
Ctrl_Com: RLYI400.2 RLYI401.2 RLYI402.2 RLYI403.2 RLYI404.2 RLYI405.2 RLYI406.2 RLYI407.2 RLYI408.2 RLYI409.2 RLYI410.2 RLYI411.2 RLYI412.2 RLYI413.2 RLYI414.2 ; port Ctrl_Com
P_OUT1: U400.2 ; port P_OUT1
P_OUT2: U401.2 ; port P_OUT2
P_OUT3: U402.2 ; port P_OUT3
P_OUT4: U403.2 ; port P_OUT4
P_OUT5: U404.2 ; port P_OUT5
P_OUT6: U405.2 ; port P_OUT6
P_OUT7: U406.2 ; port P_OUT7
P_OUT8: U407.2 ; port P_OUT8
P_OUT9: U408.2 ; port P_OUT9
P_OUT10: U409.2 ; port P_OUT10
P_OUT11: U410.2 ; port P_OUT11
P_OUT12: U411.2 ; port P_OUT12
P_OUT13: U412.2 ; port P_OUT13
P_OUT14: U413.2 ; port P_OUT14
P_OUT15: U414.2 ; port P_OUT15
NetQ400_1: Q400.1(B) R406.1 R412.2
NetQ401_1: Q401.1(B) R407.1 R413.2
NetQ402_1: Q402.1(B) R408.1 R414.2
NetQ403_1: Q403.1(B) R409.1 R415.2
NetQ404_1: Q404.1(B) R410.1 R416.2
NetQ405_1: Q405.1(B) R411.1 R417.2
NetQ406_1: Q406.1(B) R424.1 R430.2
NetQ407_1: Q407.1(B) R425.1 R431.2
NetQ408_1: Q408.1(B) R426.1 R432.2
NetQ409_1: Q409.1(B) R427.1 R433.2
NetQ410_1: Q410.1(B) R428.1 R434.2
NetQ411_1: Q411.1(B) R429.1 R435.2
NetQ412_1: Q412.1(B) R439.1 R442.2
NetQ413_1: Q413.1(B) R440.1 R443.2
NetQ414_1: Q414.1(B) R441.1 R444.2
NetR400_2: R400.2 U400.1
NetR401_2: R401.2 U401.1
NetR402_2: R402.2 U402.1
NetR403_2: R403.2 U403.1
NetR404_2: R404.2 U404.1
NetR405_2: R405.2 U405.1
NetR406_2: R406.2 U400.3
NetR407_2: R407.2 U401.3
NetR408_2: R408.2 U402.3
NetR409_2: R409.2 U403.3
NetR410_2: R410.2 U404.3
NetR411_2: R411.2 U405.3
NetR418_2: R418.2 U406.1
NetR419_2: R419.2 U407.1
NetR420_2: R420.2 U408.1
NetR421_2: R421.2 U409.1
NetR422_2: R422.2 U410.1
NetR423_2: R423.2 U411.1
NetR424_2: R424.2 U406.3
NetR425_2: R425.2 U407.3
NetR426_2: R426.2 U408.3
NetR427_2: R427.2 U409.3
NetR428_2: R428.2 U410.3
NetR429_2: R429.2 U411.3
NetR436_2: R436.2 U412.1
NetR437_2: R437.2 U413.1
NetR438_2: R438.2 U414.1
NetR439_2: R439.2 U412.3
NetR440_2: R440.2 U413.3
NetR441_2: R441.2 U414.3

### Library data of the parts
D400-D414 = DIODE
D415 = D Zener: Zener Diode; Published: 8-Jun-2000; LatestRevisionDate: 17-Jul-2002; LatestRevisionNote: Re-released for DXP Platform.; PackageReference: DIODE-0.7; Publisher: Altium Limited
JP400 JP401 R400-R444 = RES2
P-JP400-P-JP414 R-JP400-R-JP414 = JUMPER
Q400-Q414 = BSS64
RLYI400-RLYI414 = Relay-SPST: Single-Pole Single-Throw Relay; Published: 24-Mar-1999; LatestRevisionDate: 17-Jul-2002; LatestRevisionNote: Re-released for DXP Platform.; PackageReference: MODULE4; Publisher: Altium Limited
U400-U414 = TLP181: 光耦隔离

## Sheet P_IN.SchDoc
size C; DocumentNumber: 3; SheetNumber: 3; SheetTotal: 9
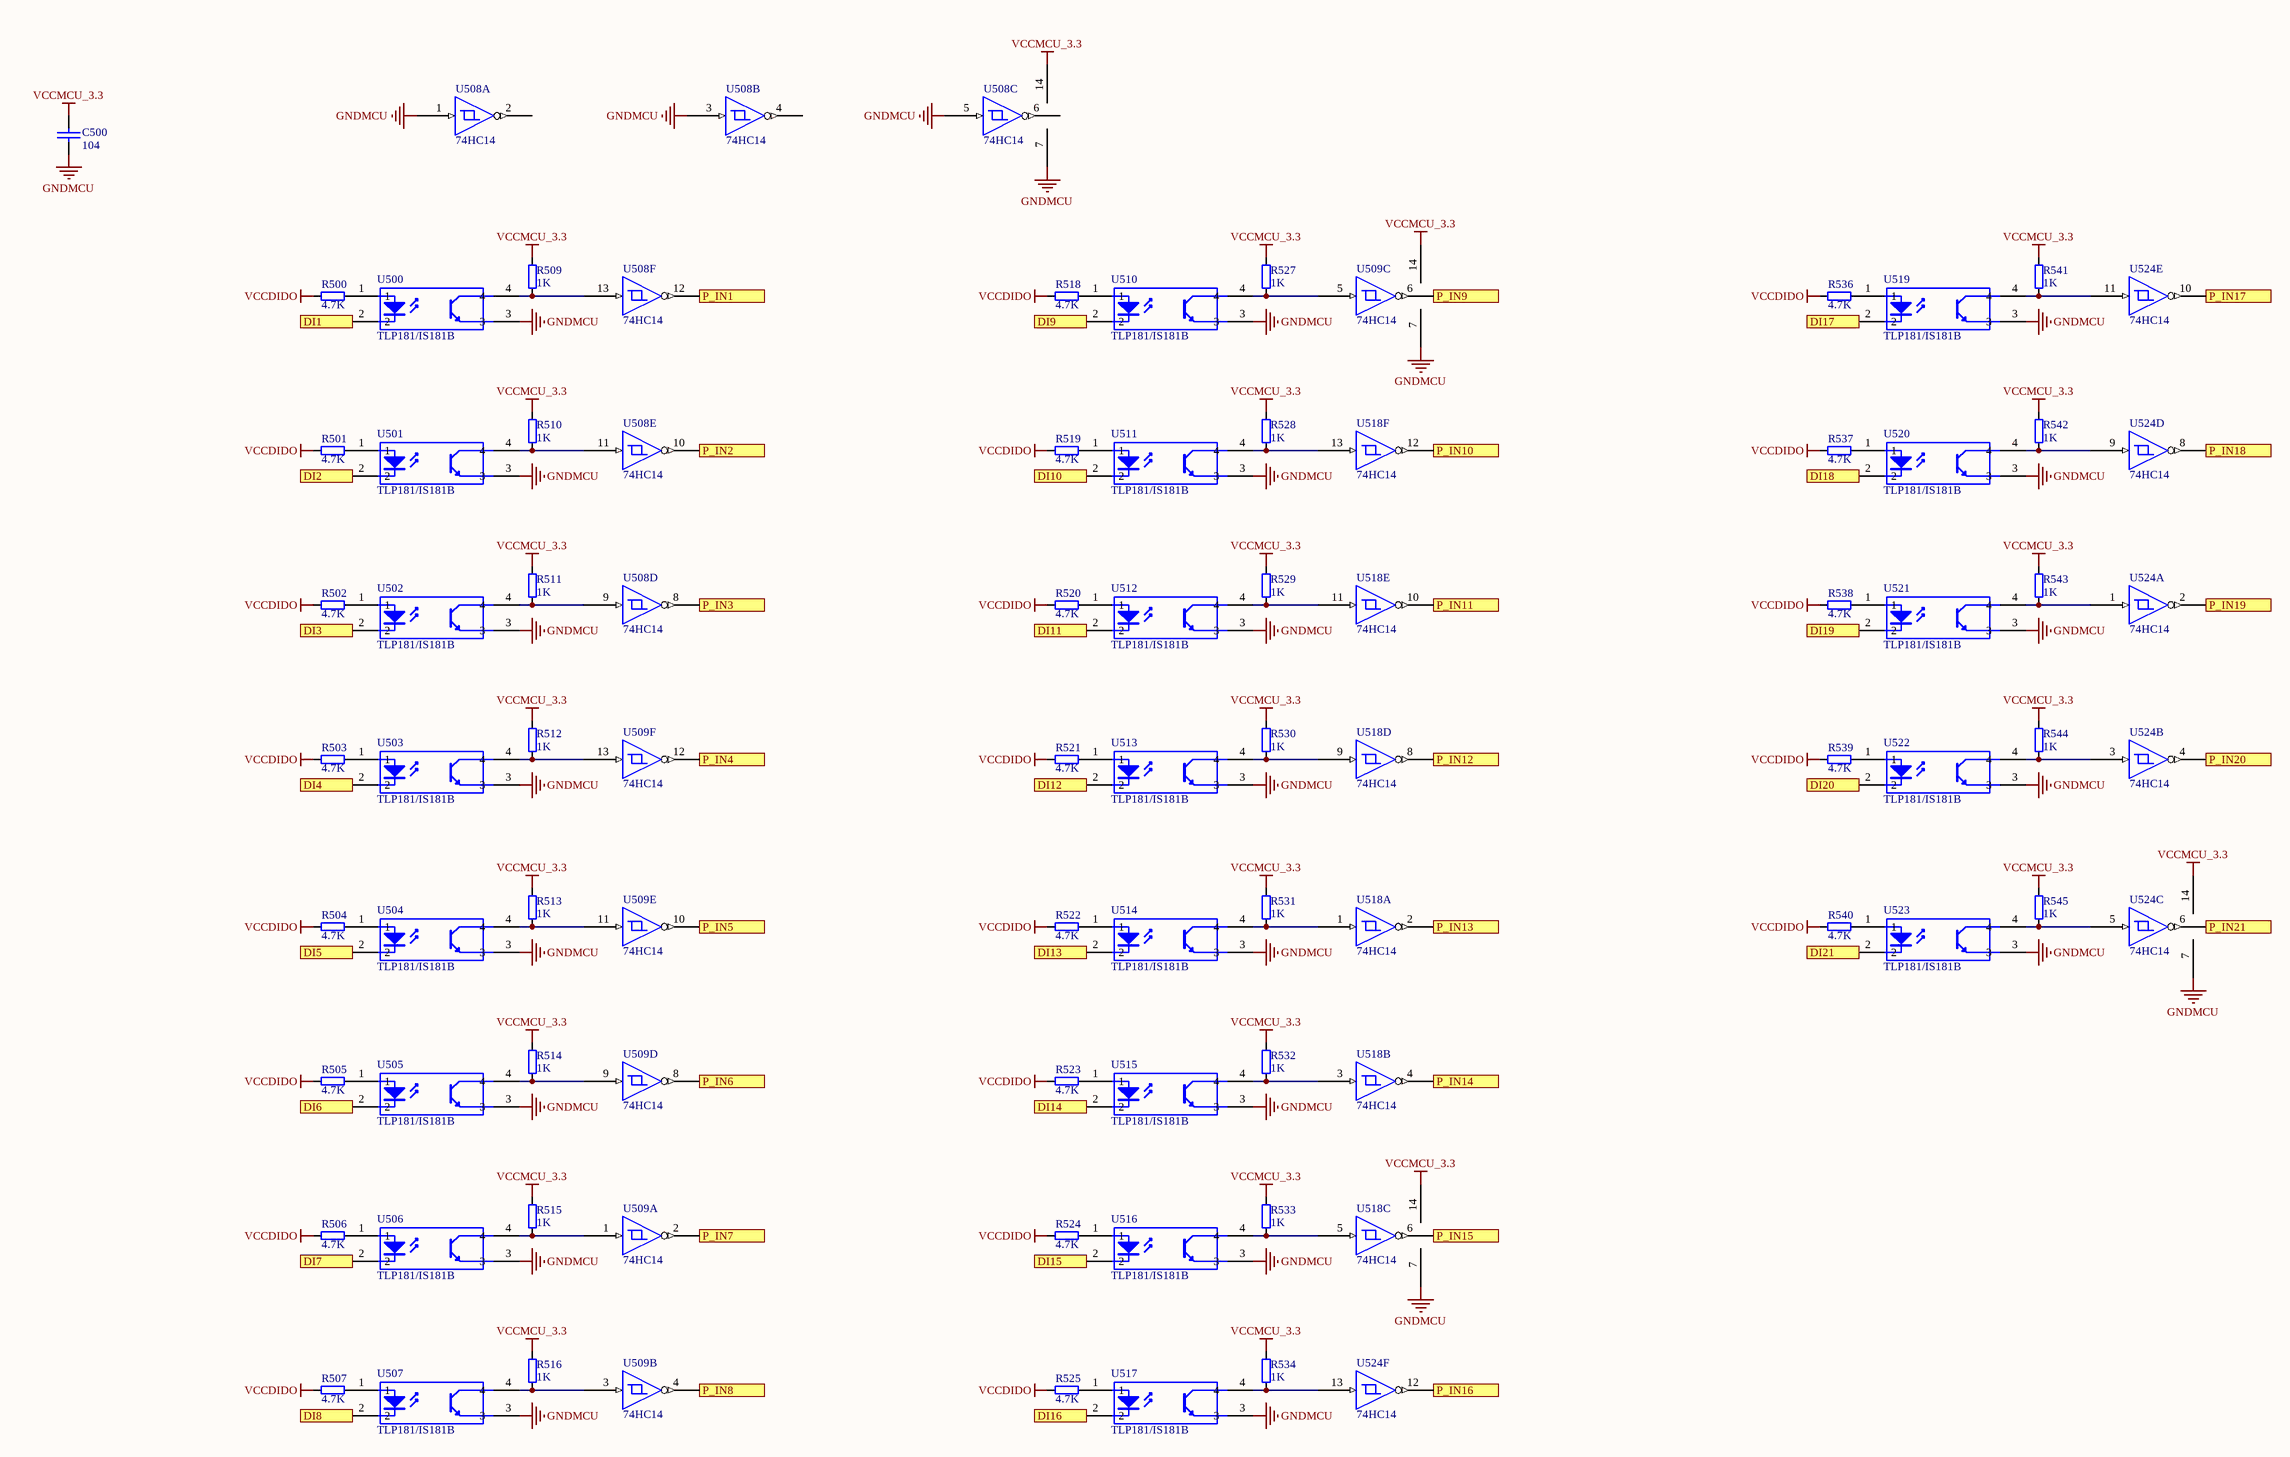
[diagram p4: P_IN.SchDoc]

### Parts
C500  104  [CAPC_E0805_2012X70N]
R500  4.7K  [RESC_E0805_2012X50N]
R501  4.7K  [RESC_E0805_2012X50N]
R502  4.7K  [RESC_E0805_2012X50N]
R503  4.7K  [RESC_E0805_2012X50N]
R504  4.7K  [RESC_E0805_2012X50N]
R505  4.7K  [RESC_E0805_2012X50N]
R506  4.7K  [RESC_E0805_2012X50N]
R507  4.7K  [RESC_E0805_2012X50N]
R509  1K  [RESC_E0805_2012X50N]
R510  1K  [RESC_E0805_2012X50N]
R511  1K  [RESC_E0805_2012X50N]
R512  1K  [RESC_E0805_2012X50N]
R513  1K  [RESC_E0805_2012X50N]
R514  1K  [RESC_E0805_2012X50N]
R515  1K  [RESC_E0805_2012X50N]
R516  1K  [RESC_E0805_2012X50N]
R518  4.7K  [RESC_E0805_2012X50N]
R519  4.7K  [RESC_E0805_2012X50N]
R520  4.7K  [RESC_E0805_2012X50N]
R521  4.7K  [RESC_E0805_2012X50N]
R522  4.7K  [RESC_E0805_2012X50N]
R523  4.7K  [RESC_E0805_2012X50N]
R524  4.7K  [RESC_E0805_2012X50N]
R525  4.7K  [RESC_E0805_2012X50N]
R527  1K  [RESC_E0805_2012X50N]
R528  1K  [RESC_E0805_2012X50N]
R529  1K  [RESC_E0805_2012X50N]
R530  1K  [RESC_E0805_2012X50N]
R531  1K  [RESC_E0805_2012X50N]
R532  1K  [RESC_E0805_2012X50N]
R533  1K  [RESC_E0805_2012X50N]
R534  1K  [RESC_E0805_2012X50N]
R536  4.7K  [RESC_E0805_2012X50N]
R537  4.7K  [RESC_E0805_2012X50N]
R538  4.7K  [RESC_E0805_2012X50N]
R539  4.7K  [RESC_E0805_2012X50N]
R540  4.7K  [RESC_E0805_2012X50N]
R541  1K  [RESC_E0805_2012X50N]
R542  1K  [RESC_E0805_2012X50N]
R543  1K  [RESC_E0805_2012X50N]
R544  1K  [RESC_E0805_2012X50N]
R545  1K  [RESC_E0805_2012X50N]
U500  TLP181/IS181B  [TLP181]
U501  TLP181/IS181B  [TLP181]
U502  TLP181/IS181B  [TLP181]
U503  TLP181/IS181B  [TLP181]
U504  TLP181/IS181B  [TLP181]
U505  TLP181/IS181B  [TLP181]
U506  TLP181/IS181B  [TLP181]
U507  TLP181/IS181B  [TLP181]
U508  74HC14  [SO-14]  (parts A,B,C,D,E,F of 6)
U509  74HC14  [SO-14]  (parts A,B,C,D,E,F of 6)
U510  TLP181/IS181B  [TLP181]
U511  TLP181/IS181B  [TLP181]
U512  TLP181/IS181B  [TLP181]
U513  TLP181/IS181B  [TLP181]
U514  TLP181/IS181B  [TLP181]
U515  TLP181/IS181B  [TLP181]
U516  TLP181/IS181B  [TLP181]
U517  TLP181/IS181B  [TLP181]
U518  74HC14  [SO-14]  (parts A,B,C,D,E,F of 6)
U519  TLP181/IS181B  [TLP181]
U520  TLP181/IS181B  [TLP181]
U521  TLP181/IS181B  [TLP181]
U522  TLP181/IS181B  [TLP181]
U523  TLP181/IS181B  [TLP181]
U524  74HC14  [SO-14]  (parts A,B,C,D,E,F of 6)

### Ports
DI1 (in), DI2 (in), DI3 (in), DI4 (in), DI5 (in), DI6 (in), DI7 (in), DI8 (in), DI9 (in), DI10 (in), DI11 (in), DI12 (in), DI13 (in), DI14 (in), DI15 (in), DI16 (in), DI17 (in), DI18 (in), DI19 (in), DI20 (in), DI21 (in), P_IN1 (out), P_IN2 (out), P_IN3 (out), P_IN4 (out), P_IN5 (out), P_IN6 (out), P_IN7 (out), P_IN8 (out), P_IN9 (out), P_IN10 (out), P_IN11 (out), P_IN12 (out), P_IN13 (out), P_IN14 (out), P_IN15 (out), P_IN16 (out), P_IN17 (out), P_IN18 (out), P_IN19 (out), P_IN20 (out), P_IN21 (out)

### Nets
GNDMCU: C500.2 U500.3 U501.3 U502.3 U503.3 U504.3 U505.3 U506.3 U507.3 U508.1 U508.3 U508.5 U508.7 U509.7 U510.3 U511.3 U512.3 U513.3 U514.3 U515.3 U516.3 U517.3 U518.7 U519.3 U520.3 U521.3 U522.3 U523.3 U524.7
VCCDIDO: R500.2 R501.2 R502.2 R503.2 R504.2 R505.2 R506.2 R507.2 R518.2 R519.2 R520.2 R521.2 R522.2 R523.2 R524.2 R525.2 R536.2 R537.2 R538.2 R539.2 R540.2
VCCMCU_3.3: C500.1 R509.2 R510.2 R511.2 R512.2 R513.2 R514.2 R515.2 R516.2 R527.2 R528.2 R529.2 R530.2 R531.2 R532.2 R533.2 R534.2 R541.2 R542.2 R543.2 R544.2 R545.2 U508.14 U509.14 U518.14 U524.14
DI1: U500.2 ; port DI1
DI2: U501.2 ; port DI2
DI3: U502.2 ; port DI3
DI4: U503.2 ; port DI4
DI5: U504.2 ; port DI5
DI6: U505.2 ; port DI6
DI7: U506.2 ; port DI7
DI8: U507.2 ; port DI8
DI9: U510.2 ; port DI9
DI10: U511.2 ; port DI10
DI11: U512.2 ; port DI11
DI12: U513.2 ; port DI12
DI13: U514.2 ; port DI13
DI14: U515.2 ; port DI14
DI15: U516.2 ; port DI15
DI16: U517.2 ; port DI16
DI17: U519.2 ; port DI17
DI18: U520.2 ; port DI18
DI19: U521.2 ; port DI19
DI20: U522.2 ; port DI20
DI21: U523.2 ; port DI21
P_IN1: U508.12 ; port P_IN1
P_IN2: U508.10 ; port P_IN2
P_IN3: U509.12 ; port P_IN4
P_IN4: U508.8 ; port P_IN3
P_IN5: U509.10 ; port P_IN5
P_IN6: U509.8 ; port P_IN6
P_IN7: U509.2 ; port P_IN7
P_IN8: U509.4 ; port P_IN8
P_IN9: U509.6 ; port P_IN9
P_IN10: U518.12 ; port P_IN10
P_IN11: U518.10 ; port P_IN11
P_IN12: U518.8 ; port P_IN12
P_IN13: U518.2 ; port P_IN13
P_IN14: U518.4 ; port P_IN14
P_IN15: U518.6 ; port P_IN15
P_IN16: U524.12 ; port P_IN16
P_IN17: U524.10 ; port P_IN17
P_IN18: U524.8 ; port P_IN18
P_IN19: U524.2 ; port P_IN19
P_IN20: U524.4 ; port P_IN20
P_IN21: U524.6 ; port P_IN21
NetR500_1: R500.1 U500.1
NetR501_1: R501.1 U501.1
NetR502_1: R502.1 U502.1
NetR503_1: R503.1 U503.1
NetR504_1: R504.1 U504.1
NetR505_1: R505.1 U505.1
NetR506_1: R506.1 U506.1
NetR507_1: R507.1 U507.1
NetR509_1: R509.1 U500.4 U508.13
NetR510_1: R510.1 U501.4 U508.11
NetR511_1: R511.1 U502.4 U508.9
NetR512_1: R512.1 U503.4 U509.13
NetR513_1: R513.1 U504.4 U509.11
NetR514_1: R514.1 U505.4 U509.9
NetR515_1: R515.1 U506.4 U509.1
NetR516_1: R516.1 U507.4 U509.3
NetR518_1: R518.1 U510.1
NetR519_1: R519.1 U511.1
NetR520_1: R520.1 U512.1
NetR521_1: R521.1 U513.1
NetR522_1: R522.1 U514.1
NetR523_1: R523.1 U515.1
NetR524_1: R524.1 U516.1
NetR525_1: R525.1 U517.1
NetR527_1: R527.1 U509.5 U510.4
NetR528_1: R528.1 U511.4 U518.13
NetR529_1: R529.1 U512.4 U518.11
NetR530_1: R530.1 U513.4 U518.9
NetR531_1: R531.1 U514.4 U518.1
NetR532_1: R532.1 U515.4 U518.3
NetR533_1: R533.1 U516.4 U518.5
NetR534_1: R534.1 U517.4 U524.13
NetR536_1: R536.1 U519.1
NetR537_1: R537.1 U520.1
NetR538_1: R538.1 U521.1
NetR539_1: R539.1 U522.1
NetR540_1: R540.1 U523.1
NetR541_1: R541.1 U519.4 U524.11
NetR542_1: R542.1 U520.4 U524.9
NetR543_1: R543.1 U521.4 U524.1
NetR544_1: R544.1 U522.4 U524.3
NetR545_1: R545.1 U523.4 U524.5

Not connected (* = marked no-connect by the designer): U508 2 4 6

### Library data of the parts
C500 = CAP: Capacitor
R500-R507 R509-R516 R518-R525 R527-R534 R536-R545 = Res: General Resistor; Postscript: 16V, 5%; Package: 0805; Mounting Type: 表面贴装; Type: Resistor
U500-U507 U510-U517 U519-U523 = TLP181: 光耦隔离
U508 U509 U518 U524 = 74LS14

## Sheet Encoder.SchDoc
size A3; DocumentNumber: 8; SheetNumber: 8; SheetTotal: 9
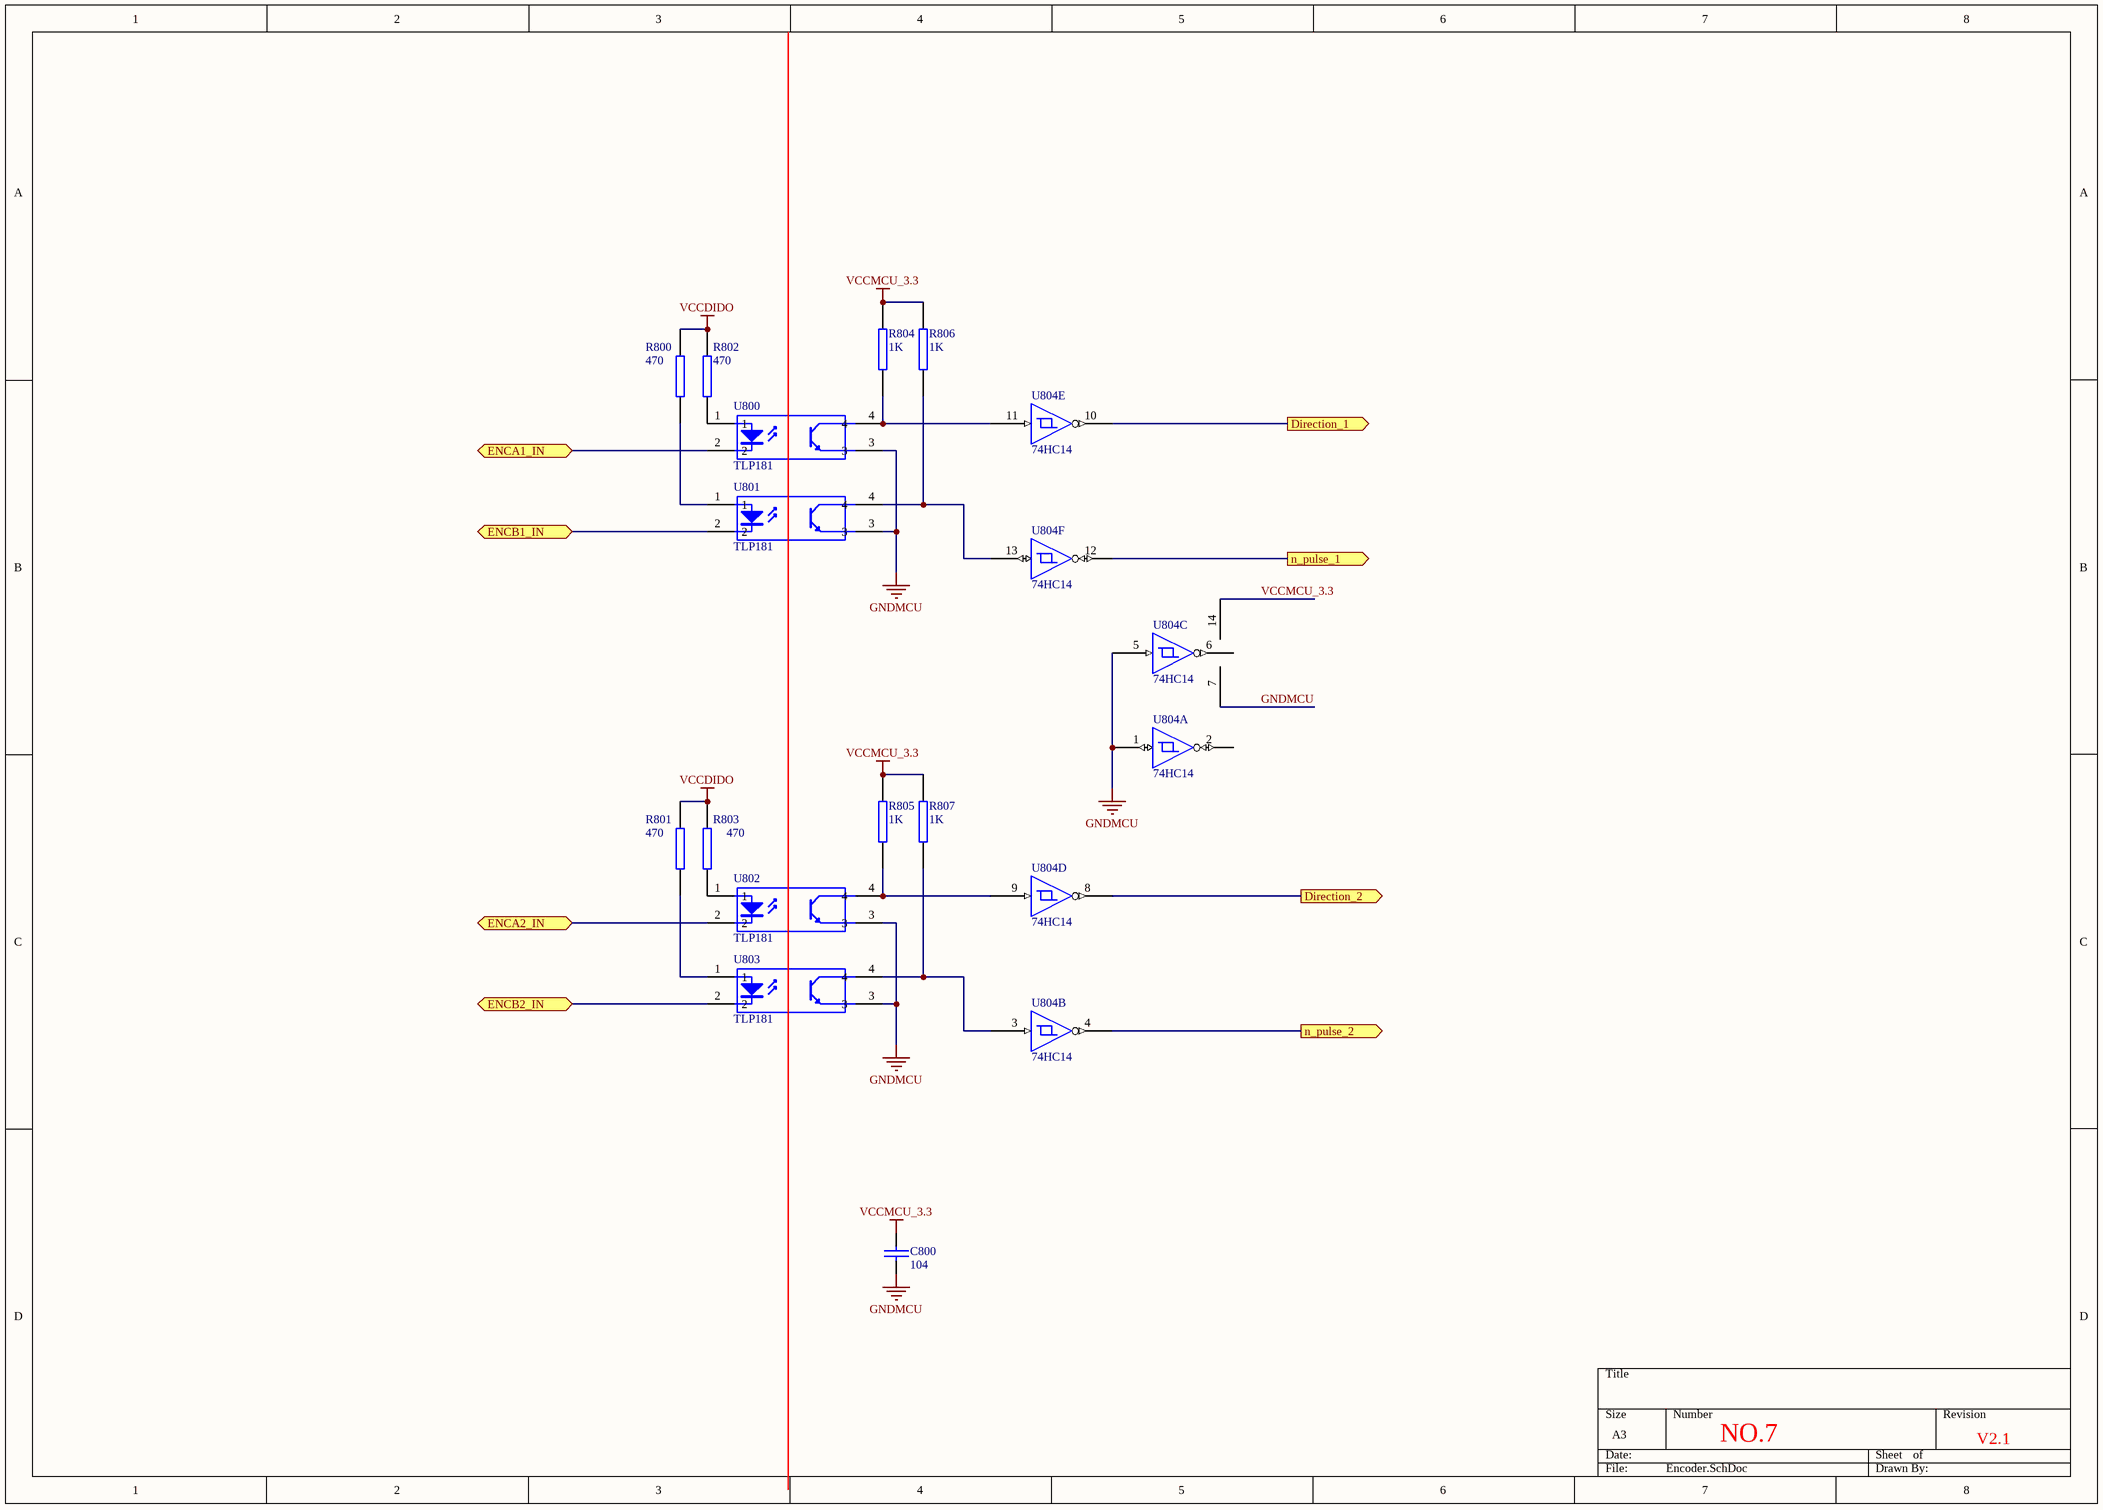
[diagram p5: Encoder.SchDoc]

### Parts
C800  104  [CAPC_E0805_2012X70N]
R800  470  [RESC_E0805_2012X50N]
R801  470  [RESC_E0805_2012X50N]
R802  470  [RESC_E0805_2012X50N]
R803  470  [RESC_E0805_2012X50N]
R804  1K  [RESC_E0805_2012X50N]
R805  1K  [RESC_E0805_2012X50N]
R806  1K  [RESC_E0805_2012X50N]
R807  1K  [RESC_E0805_2012X50N]
U800  TLP181  [TLP181]
U801  TLP181  [TLP181]
U802  TLP181  [TLP181]
U803  TLP181  [TLP181]
U804  74HC14  [SO-14]  (parts A,B,C,D,E,F of 6)

### Ports
Direction_1, Direction_2, ENCA1_IN, ENCA2_IN, ENCB1_IN, ENCB2_IN, n_pulse_1, n_pulse_2

### Nets
GNDMCU: C800.2 U800.3 U801.3 U802.3 U803.3 U804.1 U804.5 U804.7
VCCDIDO: R800.1 R801.2 R802.2 R803.1
VCCMCU_3.3: C800.1 R804.1 R805.1 R806.1 R807.1 U804.14
Direction_1: U804.10 ; port Direction_1
Direction_2: U804.8 ; port Direction_2
ENCA1_IN: U800.2 ; port ENCA1_IN
ENCA2_IN: U802.2 ; port ENCA2_IN
ENCB1_IN: U801.2 ; port ENCB1_IN
ENCB2_IN: U803.2 ; port ENCB2_IN
n_pulse_1: U804.12 ; port n_pulse_1
n_pulse_2: U804.4 ; port n_pulse_2
NetR800_2: R800.2 U801.1
NetR801_1: R801.1 U803.1
NetR802_1: R802.1 U800.1
NetR803_2: R803.2 U802.1
NetR804_2: R804.2 U800.4 U804.11
NetR805_2: R805.2 U802.4 U804.9
NetR806_2: R806.2 U801.4 U804.13
NetR807_2: R807.2 U803.4 U804.3

Not connected (* = marked no-connect by the designer): U804 2 6

### Notes on the sheet
- NO.7
- V2.1

### Library data of the parts
C800 = CAP: Capacitor
R800-R807 = RES2
U800-U803 = TLP181: 光耦隔离
U804 = 74LS14

## Nets that join several sheets
EX_GND: DGCtrl (M_J5.3), MotorControl (32 pins)
EX_V+: DGCtrl (M_J6.1), MotorControl (47 pins)
GNDDIDO: DGCtrl (D4.1 JP3.2 M_J10.2), MotorControl (JP401.2)
GNDMCU: DGCtrl (47 pins), P_IN (29 pins), Encoder (8 pins)
VCCDIDO: DGCtrl (D4.2 JP4.2 M_J10.3), MotorControl (JP400.2), P_IN (21 pins), Encoder (R800.1 R801.2 R802.2 R803.1)
VCCMCU_3.3: DGCtrl (32 pins), MotorControl (15 pins), P_IN (26 pins), Encoder (6 pins)
Ctrl1: DGCtrl (M_J9.2), MotorControl (P-JP400.1 R-JP400.1)
Ctrl2: DGCtrl (M_J9.1), MotorControl (P-JP401.1 R-JP401.1)
Ctrl3: DGCtrl (M_J8.2), MotorControl (P-JP402.1 R-JP402.1)
Ctrl4: DGCtrl (M_J8.1), MotorControl (P-JP403.1 R-JP403.1)
Ctrl5: DGCtrl (M_J7.3), MotorControl (P-JP404.1 R-JP404.1)
Ctrl6: DGCtrl (M_J7.2), MotorControl (P-JP405.1 R-JP405.1)
Ctrl7: DGCtrl (M_J7.1), MotorControl (P-JP406.1 R-JP406.1)
Ctrl8: DGCtrl (M_J6.3), MotorControl (P-JP407.1 R-JP407.1)
Ctrl9: DGCtrl (M_J6.2), MotorControl (P-JP408.1 R-JP408.1)
Ctrl10: DGCtrl (M_J4.2), MotorControl (P-JP409.1 R-JP409.1)
Ctrl11: DGCtrl (M_J4.1), MotorControl (P-JP410.1 R-JP410.1)
Ctrl12: DGCtrl (M_J3.3), MotorControl (P-JP411.1 R-JP411.1)
Ctrl13: DGCtrl (M_J3.2), MotorControl (P-JP412.1 R-JP412.1)
Ctrl14: DGCtrl (M_J3.1), MotorControl (P-JP413.1 R-JP413.1)
Ctrl15: DGCtrl (M_J2.3), MotorControl (P-JP414.1 R-JP414.1)
Ctrl_Com: DGCtrl (M_J4.3), MotorControl (15 pins)
DI1: DGCtrl (M_J17.2), P_IN (U500.2)
DI2: DGCtrl (M_J17.3), P_IN (U501.2)
DI3: DGCtrl (M_J16.1), P_IN (U502.2)
DI4: DGCtrl (M_J16.2), P_IN (U503.2)
DI5: DGCtrl (M_J16.3), P_IN (U504.2)
DI6: DGCtrl (M_J15.1), P_IN (U505.2)
DI7: DGCtrl (M_J15.2), P_IN (U506.2)
DI8: DGCtrl (M_J15.3), P_IN (U507.2)
DI9: DGCtrl (M_J14.1), P_IN (U510.2)
DI10: DGCtrl (M_J14.2), P_IN (U511.2)
DI11: DGCtrl (M_J14.3), P_IN (U512.2)
DI12: DGCtrl (M_J13.1), P_IN (U513.2)
DI13: DGCtrl (M_J13.2), P_IN (U514.2)
DI14: DGCtrl (M_J13.3), P_IN (U515.2)
DI15: DGCtrl (M_J12.1), P_IN (U516.2)
DI16: DGCtrl (M_J12.2), P_IN (U517.2)
DI17: DGCtrl (M_J12.3), P_IN (U519.2)
DI18: DGCtrl (M_J11.1), P_IN (U520.2)
DI19: DGCtrl (M_J11.2), P_IN (U521.2)
DI20: DGCtrl (M_J11.3), P_IN (U522.2)
DI21: DGCtrl (M_J10.1), P_IN (U523.2)
Direction_1: DGCtrl (U3.32), Encoder (U804.10)
Direction_2: DGCtrl (U3.64), Encoder (U804.8)
ENCA1_IN: DGCtrl (M_J18.2), Encoder (U800.2)
ENCA2_IN: DGCtrl (M_J18.3), Encoder (U802.2)
ENCB1_IN: DGCtrl (M_J18.1), Encoder (U801.2)
ENCB2_IN: DGCtrl (M_J17.1), Encoder (U803.2)
n_pulse_1: DGCtrl (U3.31), Encoder (U804.12)
n_pulse_2: DGCtrl (U3.63), Encoder (U804.4)
P_IN1: DGCtrl (U3.57), P_IN (U508.12)
P_IN2: DGCtrl (U3.56), P_IN (U508.10)
P_IN3: DGCtrl (U3.55), P_IN (U509.12)
P_IN4: DGCtrl (U3.66), P_IN (U508.8)
P_IN5: DGCtrl (U3.65), P_IN (U509.10)
P_IN6: DGCtrl (U3.62), P_IN (U509.8)
P_IN7: DGCtrl (U3.61), P_IN (U509.2)
P_IN8: DGCtrl (U3.60), P_IN (U509.4)
P_IN9: DGCtrl (U3.58), P_IN (U509.6)
P_IN10: DGCtrl (U3.79), P_IN (U518.12)
P_IN11: DGCtrl (U3.3), P_IN (U518.10)
P_IN12: DGCtrl (U3.78), P_IN (U518.8)
P_IN13: DGCtrl (U3.71), P_IN (U518.2)
P_IN14: DGCtrl (U3.70), P_IN (U518.4)
P_IN15: DGCtrl (U3.67), P_IN (U518.6)
P_IN16: DGCtrl (U3.88), P_IN (U524.12)
P_IN17: DGCtrl (U3.87), P_IN (U524.10)
P_IN18: DGCtrl (U3.86), P_IN (U524.8)
P_IN19: DGCtrl (U3.85), P_IN (U524.2)
P_IN20: DGCtrl (U3.84), P_IN (U524.4)
P_IN21: DGCtrl (U3.83), P_IN (U524.6)
P_OUT1: DGCtrl (U3.4), MotorControl (U400.2)
P_OUT2: DGCtrl (U3.23), MotorControl (U401.2)
P_OUT3: DGCtrl (U3.40), MotorControl (U402.2)
P_OUT4: DGCtrl (U3.89), MotorControl (U403.2)
P_OUT5: DGCtrl (U3.90), MotorControl (U404.2)
P_OUT6: DGCtrl (U3.91), MotorControl (U405.2)
P_OUT7: DGCtrl (U3.92), MotorControl (U406.2)
P_OUT8: DGCtrl (U3.93), MotorControl (U407.2)
P_OUT9: DGCtrl (U3.95), MotorControl (U408.2)
P_OUT10: DGCtrl (U3.77), MotorControl (U409.2)
P_OUT11: DGCtrl (U3.59), MotorControl (U410.2)
P_OUT12: DGCtrl (U3.1), MotorControl (U411.2)
P_OUT13: DGCtrl (U3.98), MotorControl (U412.2)
P_OUT14: DGCtrl (U3.97), MotorControl (U413.2)
P_OUT15: DGCtrl (U3.96), MotorControl (U414.2)